# EAGLE design bottomPCB_f1 (EAGLE 8.4.2)
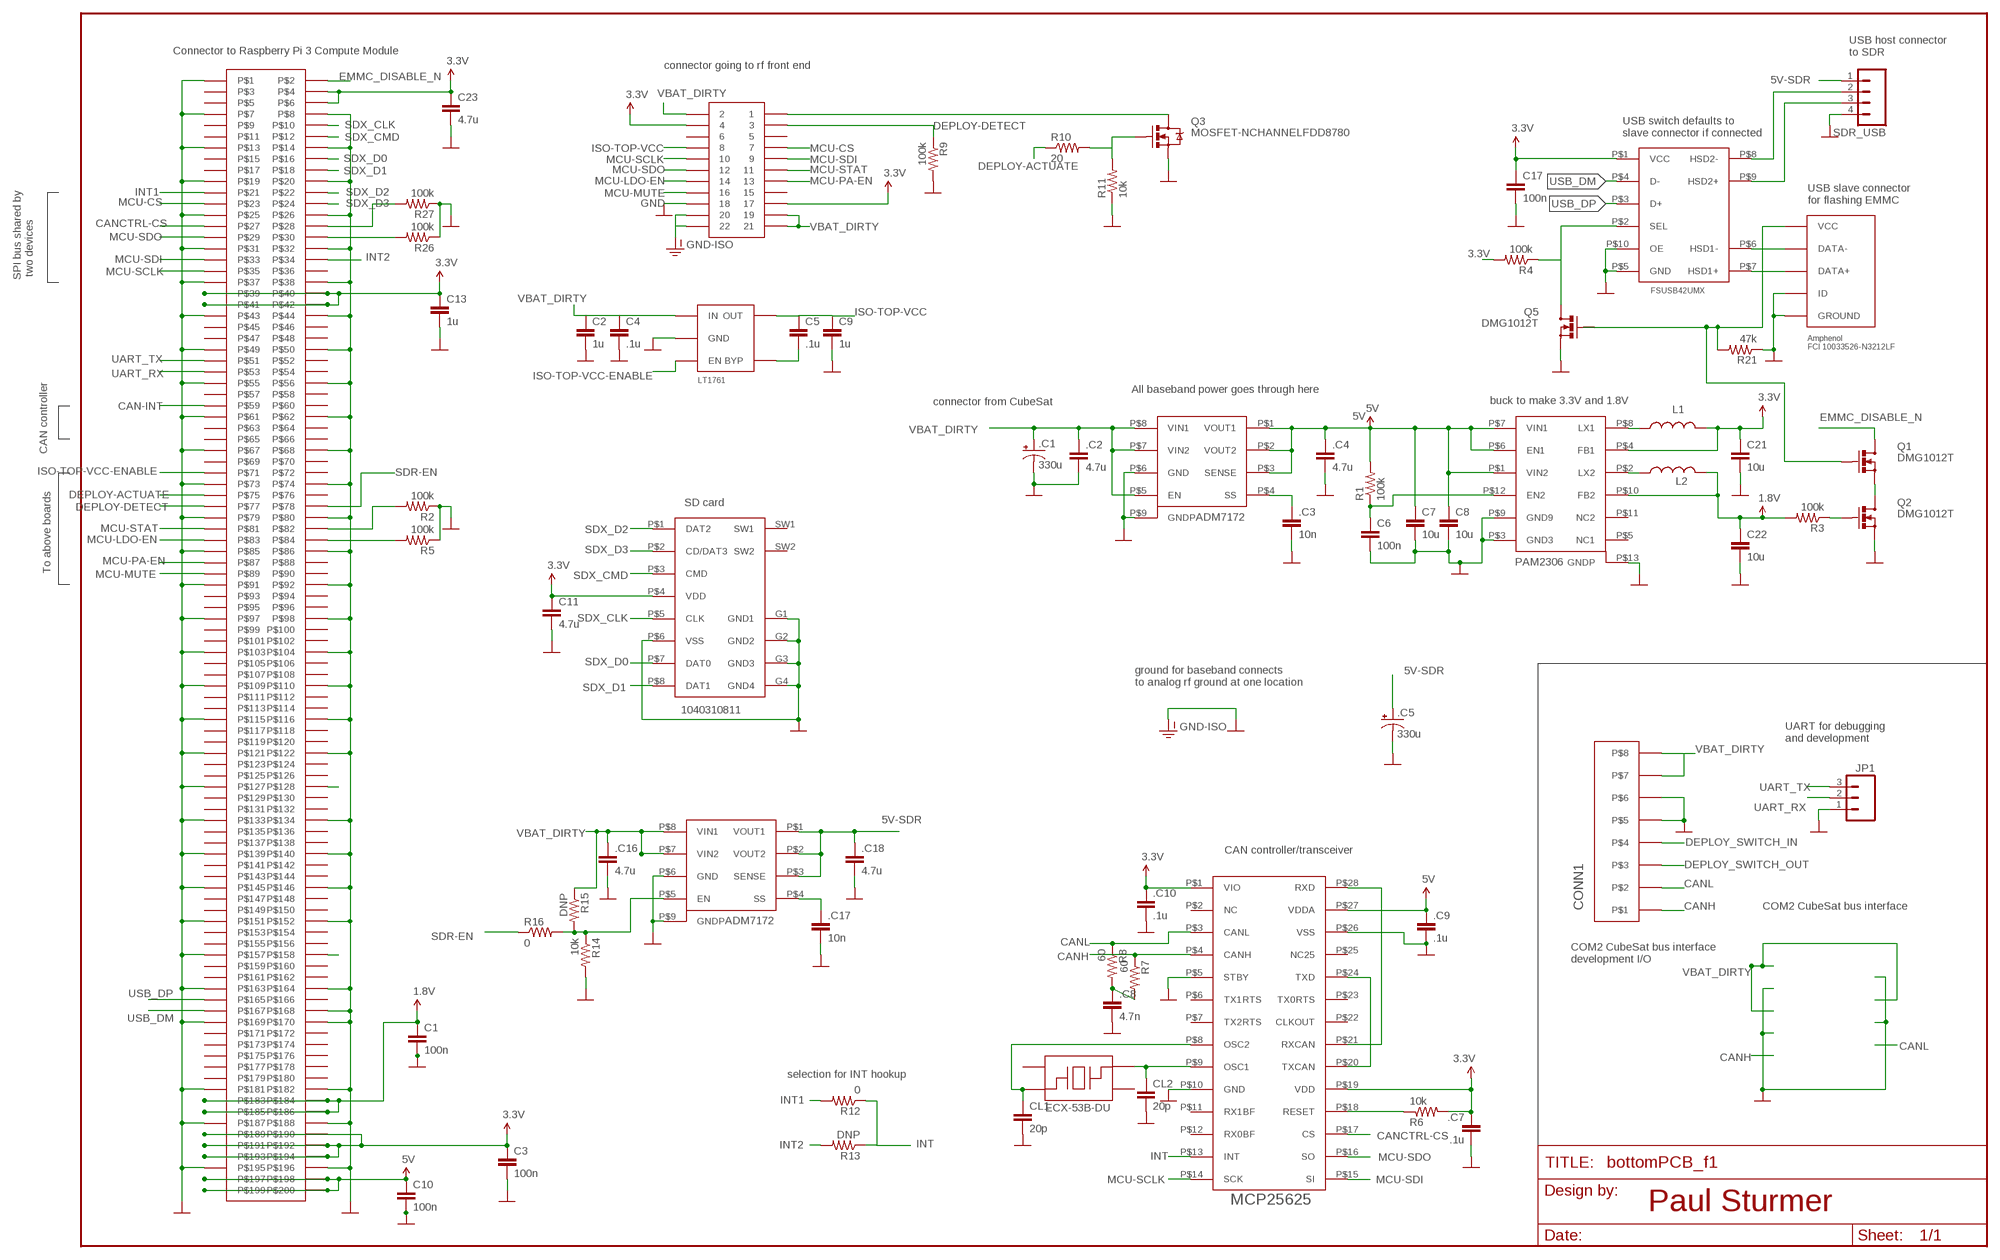
[diagram p0: schematic, sheet 1]

## Parts
.C1  330u  CAP_POL7343  [EIA7343]
.C2  4.7u  CAP1206  [1206]
.C3  10n  CAP0805  [0805]
.C4  4.7u  CAP1206  [1206]
.C5  330u  CAP_POL7343  [EIA7343]
.C7  .1u  CAP0805  [0805]
.C8  4.7n  CAP0805  [0805]
.C9  .1u  CAP0805  [0805]
.C10  .1u  CAP0805  [0805]
.C16  4.7u  CAP1206  [1206]
.C17  10n  CAP0805  [0805]
.C18  4.7u  CAP1206  [1206]
C1  100n  CAP0805  [0805]
C2  1u  CAP0805  [0805]
C3  100n  CAP0805  [0805]
C4  .1u  CAP0805  [0805]
C5  .1u  CAP0805  [0805]
C6  100n  CAP0805  [0805]
C7  10u  CAP1206  [1206]
C8  10u  CAP1206  [1206]
C9  1u  CAP0805  [0805]
C10  100n  CAP0805  [0805]
C11  4.7u  CAP0805  [0805]
C13  1u  CAP0805  [0805]
C17  100n  CAP0805  [0805]
C21  10u  CAP1206  [1206]
C22  10u  CAP1206  [1206]
C23  4.7u  CAP0805  [0805]
CL1  20p  CAP0805  [0805]
CL2  20p  CAP0805  [0805]
CONN1  PICOLOCK_8PICOLOCK_8  [PICOLOCK_8]
JP1  M03LOCK  [1X03_LOCK]
L1  INDUCTOR_SRN4018  [SDR0403]
L2  INDUCTOR_SRN4018  [SDR0403]
Q1  DMG1012T  [SOT523]
Q2  DMG1012T  [SOT523]
Q3  MOSFET-NCHANNELFDD8780  [DPAK]
Q5  DMG1012T  [SOT523]
R1  100k  RESISTOR0805-RES  [0805]
R2  100k  RESISTOR0805-RES  [0805]
R3  100k  RESISTOR0805-RES  [0805]
R4  100k  RESISTOR0805-RES  [0805]
R5  100k  RESISTOR0805-RES  [0805]
R6  10k  RESISTOR0805-RES  [0805]
R7  60  RESISTOR0805-RES  [0805]
R8  60  RESISTOR0805-RES  [0805]
R9  100k  RESISTOR0805-RES  [0805]
R10  20  RESISTOR0805-RES  [0805]
R11  10k  RESISTOR0805-RES  [0805]
R12  0  RESISTOR0805-RES  [0805]
R13  DNP  RESISTOR0805-RES  [0805]
R14  10k  RESISTOR0805-RES  [0805]
R15  DNP  RESISTOR0805-RES  [0805]
R16  0  RESISTOR0805-RES  [0805]
R21  47k  RESISTOR0805-RES  [0805]
R26  100k  RESISTOR0805-RES  [0805]
R27  100k  RESISTOR0805-RES  [0805]
SDR_USB  M04LOCK  [1X04_LOCK]
U$15  USB_MINI-B_AMPHENOL  [USB_MINI_B]
U$16  ANALOG_LDO_ADM7172  [8-LFCSP]
U$17  DIDOESINCORPORATED_BUCK_PAM2306  [WDFN-12L]
U$18  MICROCHIP_CAN_MCP25625_SSOP  [SSOP-28]
U$19  FAIRCHILD_USB_FSUSB42UMX  [MSOP_10_LEAD]
U$20  LINEAR_LDO_LT1761-X  [SOT-23-5]
U$21  DDR2_AMPHENOL_10033853-052FSLF  [DDR2]
U$22  SD_CARD_1040310811  [SD_CARD_1040310811]
U$24  ECS_CRYSTAL_ECX-53B-DU  [SMD_CRYSTAL]
U$26  ANALOG_LDO_ADM7172  [8-LFCSP]
U$180  SSW-111-XX-XXX-D  [SSW-111-XX-XXX-D]

## Nets
1.8V: C1.1 C22.1 L2.P$2 R3.2 U$17.P$10(FB2) U$21.P$183 U$21.P$184 U$21.P$185 U$21.P$186
3.3V: .C7.1 .C10.1 C3.1 C11.1 C13.1 C17.1 C21.1 C23.1 L1.P$2 R4.2 R6.2 U$17.P$4(FB1) U$18.P$1(VIO) U$18.P$19(VDD) U$19.P$1(VCC) U$21.P$4 U$21.P$6 U$21.P$39 U$21.P$40 U$21.P$41 U$21.P$42 U$21.P$189 U$21.P$190 U$21.P$191 U$21.P$192 U$21.P$193 U$21.P$194 U$22.P$4(VDD) U$180.4 U$180.17
5V: .C4.1 .C9.1 C7.1 C8.1 C10.1 R1.2 U$16.P$1(VOUT1) U$16.P$2(VOUT2) U$16.P$3(SENSE) U$17.P$1(VIN2) U$17.P$6(EN1) U$17.P$7(VIN1) U$18.P$27(VDDA) U$21.P$197 U$21.P$198 U$21.P$199 U$21.P$200
5V-SDR: .C5.A(+) .C18.1 SDR_USB.1 U$26.P$1(VOUT1) U$26.P$2(VOUT2) U$26.P$3(SENSE)
CAN-INT: U$21.P$59
CANCTRL-CS: U$18.P$17(CS) U$21.P$27
CANH: CONN1.P$1 R7.1 U$18.P$4(CANH)
CANL: CONN1.P$2 R8.1 U$18.P$3(CANL)
DEPLOY-ACTUATE: R10.1 U$21.P$75
DEPLOY-DETECT: R9.1 U$21.P$77 U$180.3
DEPLOY_NEG: Q3.4(D) U$180.1
DEPLOY_SWITCH_IN: CONN1.P$4
DEPLOY_SWITCH_OUT: CONN1.P$3
EMMC_DISABLE_N: Q1.D U$21.P$2
EN: R14.1 R15.2 R16.2 U$26.P$5(EN)
GND: .C1.C(-) .C2.2 .C3.2 .C4.2 .C5.C(-) .C7.2 .C8.2 .C9.2 .C10.2 .C16.2 .C17.2 .C18.2 C1.2 C2.2 C3.2 C4.2 C6.2 C7.2 C8.2 C9.2 C10.2 C11.2 C13.2 C17.2 C21.2 C22.2 C23.2 CL1.2 CL2.2 CONN1.P$5 CONN1.P$6 JP1.1 Q2.S Q3.3(S) Q5.S R2.1 R5.1 R9.2 R11.1 R14.2 R21.1 R26.1 R27.1 SDR_USB.4 U$15.GND1(GROUND) U$15.GND2(GROUND) U$15.GND3(GROUND) U$15.GND4(GROUND) U$15.GROUND U$15.ID U$16.P$6(GND) U$16.P$9(GNDP) U$17.P$3(GND3) U$17.P$9(GND9) U$17.P$13(GNDP) U$18.P$5(STBY) U$18.P$10(GND) U$18.P$26(VSS) U$19.P$5(GND) U$19.P$10(OE) U$20.P$2(GND) U$21.P$1 U$21.P$7 U$21.P$8 U$21.P$13 U$21.P$14 U$21.P$19 U$21.P$20 U$21.P$25 U$21.P$26 U$21.P$31 U$21.P$32 U$21.P$37 U$21.P$38 U$21.P$43 U$21.P$44 U$21.P$49 U$21.P$50 U$21.P$55 U$21.P$56 U$21.P$61 U$21.P$62 U$21.P$67 U$21.P$68 U$21.P$73 U$21.P$74 U$21.P$79 U$21.P$80 U$21.P$85 U$21.P$86 U$21.P$91 U$21.P$92 U$21.P$97 U$21.P$98 U$21.P$103 U$21.P$104 U$21.P$109 U$21.P$110 U$21.P$115 U$21.P$116 U$21.P$121 U$21.P$122 U$21.P$127 U$21.P$133 U$21.P$134 U$21.P$139 U$21.P$140 U$21.P$145 U$21.P$146 U$21.P$151 U$21.P$152 U$21.P$157 U$21.P$163 U$21.P$164 U$21.P$168 U$21.P$169 U$21.P$170 U$21.P$181 U$21.P$182 U$21.P$187 U$21.P$188 U$21.P$195 U$21.P$196 U$22.G1(GND1) U$22.G2(GND2) U$22.G3(GND3) U$22.G4(GND4) U$22.P$6(VSS) U$26.P$6(GND) U$26.P$9(GNDP) U$180.18 U$180.20 U$180.22 ; supply symbol labelled DGND, GND-ISO
INT: R12.1 R13.1 U$18.P$13(INT)
INT1: R12.2 U$21.P$21
INT2: R13.2 U$21.P$34
ISO-TOP-VCC: C5.1 C9.1 U$20.P$5(OUT) U$180.8
ISO-TOP-VCC-ENABLE: U$20.P$3(EN) U$21.P$71
MCU-CS: U$21.P$23 U$180.7
MCU-LDO-EN: U$21.P$83 U$180.14
MCU-MUTE: U$21.P$89 U$180.16
MCU-PA-EN: U$21.P$87 U$180.13
MCU-SCLK: U$18.P$14(SCK) U$21.P$35 U$180.10
MCU-SDI: U$18.P$15(SI) U$21.P$33 U$180.9
MCU-SDO: U$18.P$16(SO) U$21.P$29 U$180.12
MCU-STAT: U$21.P$81 U$180.11
N$1: L1.P$1 U$17.P$8(LX1)
N$2: .C3.1 U$16.P$4(SS)
N$3: Q1.S Q2.D
N$4: L2.P$1 U$17.P$2(LX2)
N$6: C6.1 R1.1 U$17.P$12(EN2)
N$7: R27.2 U$21.P$28
N$8: R26.2 U$21.P$30
N$9: U$15.DATA- U$19.P$6(HSD1-)
N$10: U$15.DATA+ U$19.P$7(HSD1+)
N$11: SDR_USB.2 U$19.P$8(HSD2-)
N$12: SDR_USB.3 U$19.P$9(HSD2+)
N$13: Q5.D R4.1 U$19.P$2(SEL)
N$14: R2.2 U$21.P$82
N$15: R5.2 U$21.P$84
N$16: C5.2 U$20.P$4(BYP)
N$17: R6.1 U$18.P$18(RESET)
N$18: U$18.P$20(TXCAN) U$18.P$24(TXD)
N$19: U$21.P$128
N$20: U$21.P$158
N$21: .C8.1 R7.2 R8.2
N$23: CL2.1 U$18.P$9(OSC1) U$24.P$3
N$24: CL1.1 U$18.P$8(OSC2) U$24.P$1
N$25: U$18.P$21(RXCAN) U$18.P$28(RXD)
N$26: Q3.1(G) R10.2 R11.2
N$31: .C17.1 U$26.P$4(SS)
Q2: Q2.G R3.1
SDR-EN: R16.1 U$21.P$78
SDX_CLK: U$21.P$10 U$22.P$5(CLK)
SDX_CMD: U$21.P$12 U$22.P$3(CMD)
SDX_D0: U$21.P$16 U$22.P$7(DAT0)
SDX_D1: U$21.P$18 U$22.P$8(DAT1)
SDX_D2: U$21.P$22 U$22.P$1(DAT2)
SDX_D3: U$21.P$24 U$22.P$2(CD/DAT3)
UART_RX: JP1.2 U$21.P$53
UART_TX: JP1.3 U$21.P$51
USB_DM: U$19.P$4(D-) U$21.P$167
USB_DP: U$19.P$3(D+) U$21.P$165
VBAT_DIRTY: .C1.A(+) .C2.1 .C16.1 C2.1 C4.1 CONN1.P$7 CONN1.P$8 R15.1 U$16.P$5(EN) U$16.P$7(VIN2) U$16.P$8(VIN1) U$20.P$1(IN) U$26.P$7(VIN2) U$26.P$8(VIN1) U$180.2 U$180.19 U$180.21
VBUSB: Q1.G Q5.G R21.2 U$15.VCC
Unconnected: U$17.P$5(NC1) U$17.P$11(NC2) U$18.P$2(NC) U$18.P$6(TX1RTS) U$18.P$7(TX2RTS) U$18.P$11(RX1BF) U$18.P$12(RX0BF) U$18.P$22(CLKOUT) U$18.P$23(TX0RTS) U$18.P$25(NC25) U$21.P$3 U$21.P$5 U$21.P$9 U$21.P$11 U$21.P$15 U$21.P$17 U$21.P$36 U$21.P$45 U$21.P$46 U$21.P$47 U$21.P$48 U$21.P$52 U$21.P$54 U$21.P$57 U$21.P$58 U$21.P$60 U$21.P$63 U$21.P$64 U$21.P$65 U$21.P$66 U$21.P$69 U$21.P$70 U$21.P$72 U$21.P$76 U$21.P$88 U$21.P$90 U$21.P$93 U$21.P$94 U$21.P$95 U$21.P$96 U$21.P$99 U$21.P$100 U$21.P$101 U$21.P$102 U$21.P$105 U$21.P$106 U$21.P$107 U$21.P$108 U$21.P$111 U$21.P$112 U$21.P$113 U$21.P$114 U$21.P$117 U$21.P$118 U$21.P$119 U$21.P$120 U$21.P$123 U$21.P$124 U$21.P$125 U$21.P$126 U$21.P$129 U$21.P$130 U$21.P$131 U$21.P$132 U$21.P$135 U$21.P$136 U$21.P$137 U$21.P$138 U$21.P$141 U$21.P$142 U$21.P$143 U$21.P$144 U$21.P$147 U$21.P$148 U$21.P$149 U$21.P$150 U$21.P$153 U$21.P$154 U$21.P$155 U$21.P$156 U$21.P$159 U$21.P$160 U$21.P$161 U$21.P$162 U$21.P$166 U$21.P$171 U$21.P$172 U$21.P$173 U$21.P$174 U$21.P$175 U$21.P$176 U$21.P$177 U$21.P$178 U$21.P$179 U$21.P$180 U$22.SW1 U$22.SW2 U$24.P$2 U$24.P$4 U$180.5 U$180.6 U$180.15

## Notes on the sheet
- Connector to Raspberry Pi 3 Compute Module
- USB host connector
  to SDR
- connector going to rf front end
- USB switch defaults to
  slave connector if connected
- USB slave connector
  for flashing EMMC
- SPI bus shared by
   two devices
- All baseband power goes through here
- connector from CubeSat | buck to make 3.3V and 1.8V
- CAN controller
- SD card
- To above boards
- ground for baseband connects 
  to analog rf ground at one location
- UART for debugging
  and development
- CAN controller/transceiver
- COM2 CubeSat bus interface
- COM2 CubeSat bus interface
  development I/O
- selection for INT hookup

## Library data of the parts
.C1 .C5 = SparkFun-Capacitors:CAP_POL: Capacitor Polarized These are standard SMD and PTH capacitors. Normally 10uF, 47uF, and 100uF in electrolytic and tantalum varieties. Always verify the external diameter of the through hole cap, it varies with capacity, voltage, and manufacturer. The EIA devices should be standard.
.C2-.C4 .C7-.C10 .C16-.C18 C1-C11 C13 C17 C21-C23 CL1 CL2 = SparkFun-Capacitors:CAP: Capacitor Standard 0603 ceramic capacitor, and 0.1" leaded capacitor.
CONN1 = DubSat1 Components:PICOLOCK_8
JP1 = SparkFun-Connectors:M03: Header 3 Standard 3-pin 0.1" header. Use with straight break away headers (SKU : PRT-00116), right angle break away headers (PRT-00553), swiss pins (PRT-00743), machine pins (PRT-00117), and female headers (PRT-00115). Molex polarized connector foot print use with SKU : PRT-08232 with associated crimp pins and housings.
L1 L2 = SparkFun-Passives:INDUCTOR_SRN4018
Q1 Q2 Q5 = SparkFun-DiscreteSemi:DMG1012T
Q3 = SparkFun-DiscreteSemi:MOSFET-NCHANNEL: Common NMOSFET Parts MFG P/N Store ID Prod ID FDD8780 TRANS-09984 SI7820DN TRANS-11055 FDS6630A IC-08089 2N7002PW TRANS-11151 FQP30N06L COM-10213 TRANS-10060 BSS123LT1G TRANS-08345 BSS138 TRANS-00830 BS170 2N7000; PROD_ID: TRANS-09984
R1-R16 R21 R26 R27 = SparkFun-Resistors:RESISTOR: Resistor Basic schematic elements and footprints for 0603, 1206, and PTH resistors.
SDR_USB = SparkFun-Connectors:M04: Header 4 Standard 4-pin 0.1" header. Use with straight break away headers (SKU : PRT-00116), right angle break away headers (PRT-00553), swiss pins (PRT-00743), machine pins (PRT-00117), and female headers (PRT-00115). Molex polarized connector foot print use with SKU : PRT-08231 with associated crimp pins and housings. 1MM SMD Version SKU: PRT-10208
U$15 = I_O_connectors:USB_MINI-B_AMPHENOL
U$16 U$26 = ICs:ANALOG_LDO_ADM7172
U$17 = ICs:DIDOESINCORPORATED_BUCK_PAM2306
U$18 = ICs:MICROCHIP_CAN_MCP25625_SSOP
U$19 = ICs:FAIRCHILD_USB_FSUSB42UMX
U$20 = ICs:LINEAR_LDO_LT1761-X
U$21 = I_O_connectors:DDR2_AMPHENOL_10033853-052FSLF
U$22 = I_O_connectors:SD_CARD_1040310811
U$24 = ICs:ECS_CRYSTAL_ECX-53B-DU
U$180 = I_O_connectors:SSW-111-XX-XXX-D

## Board
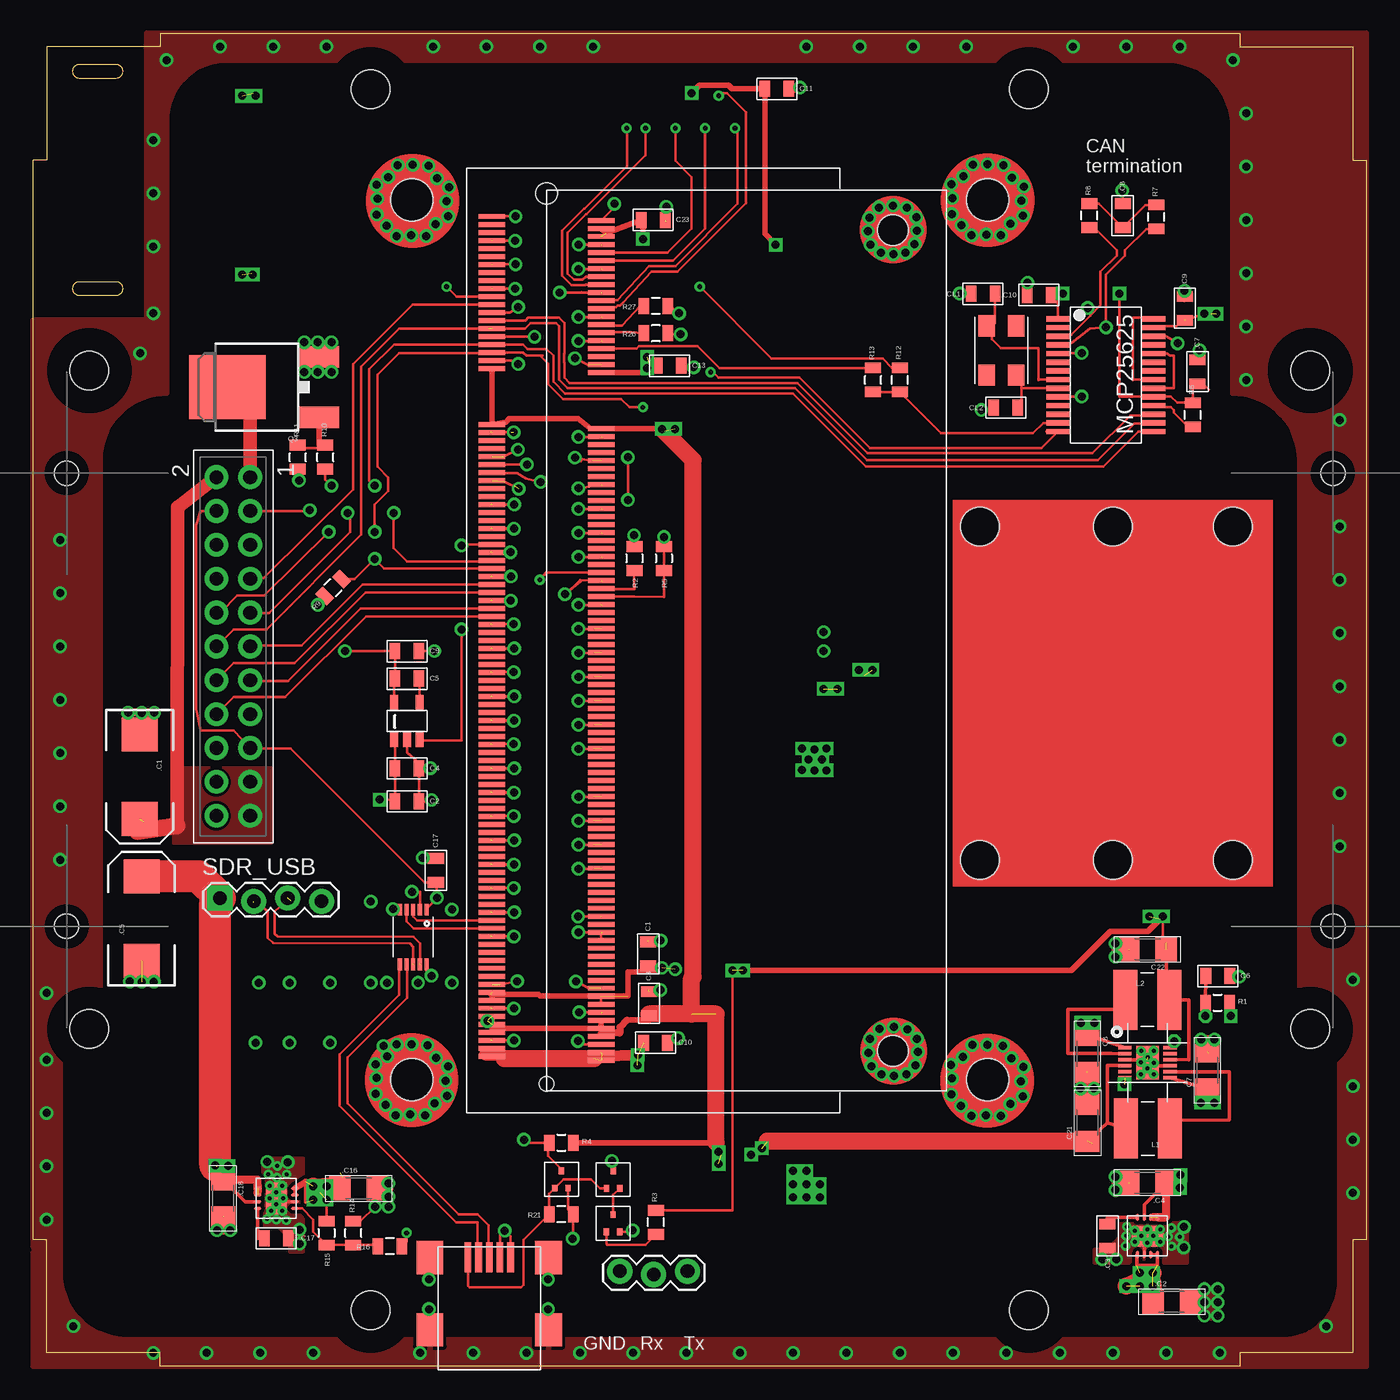
[diagram p1: board, top side]
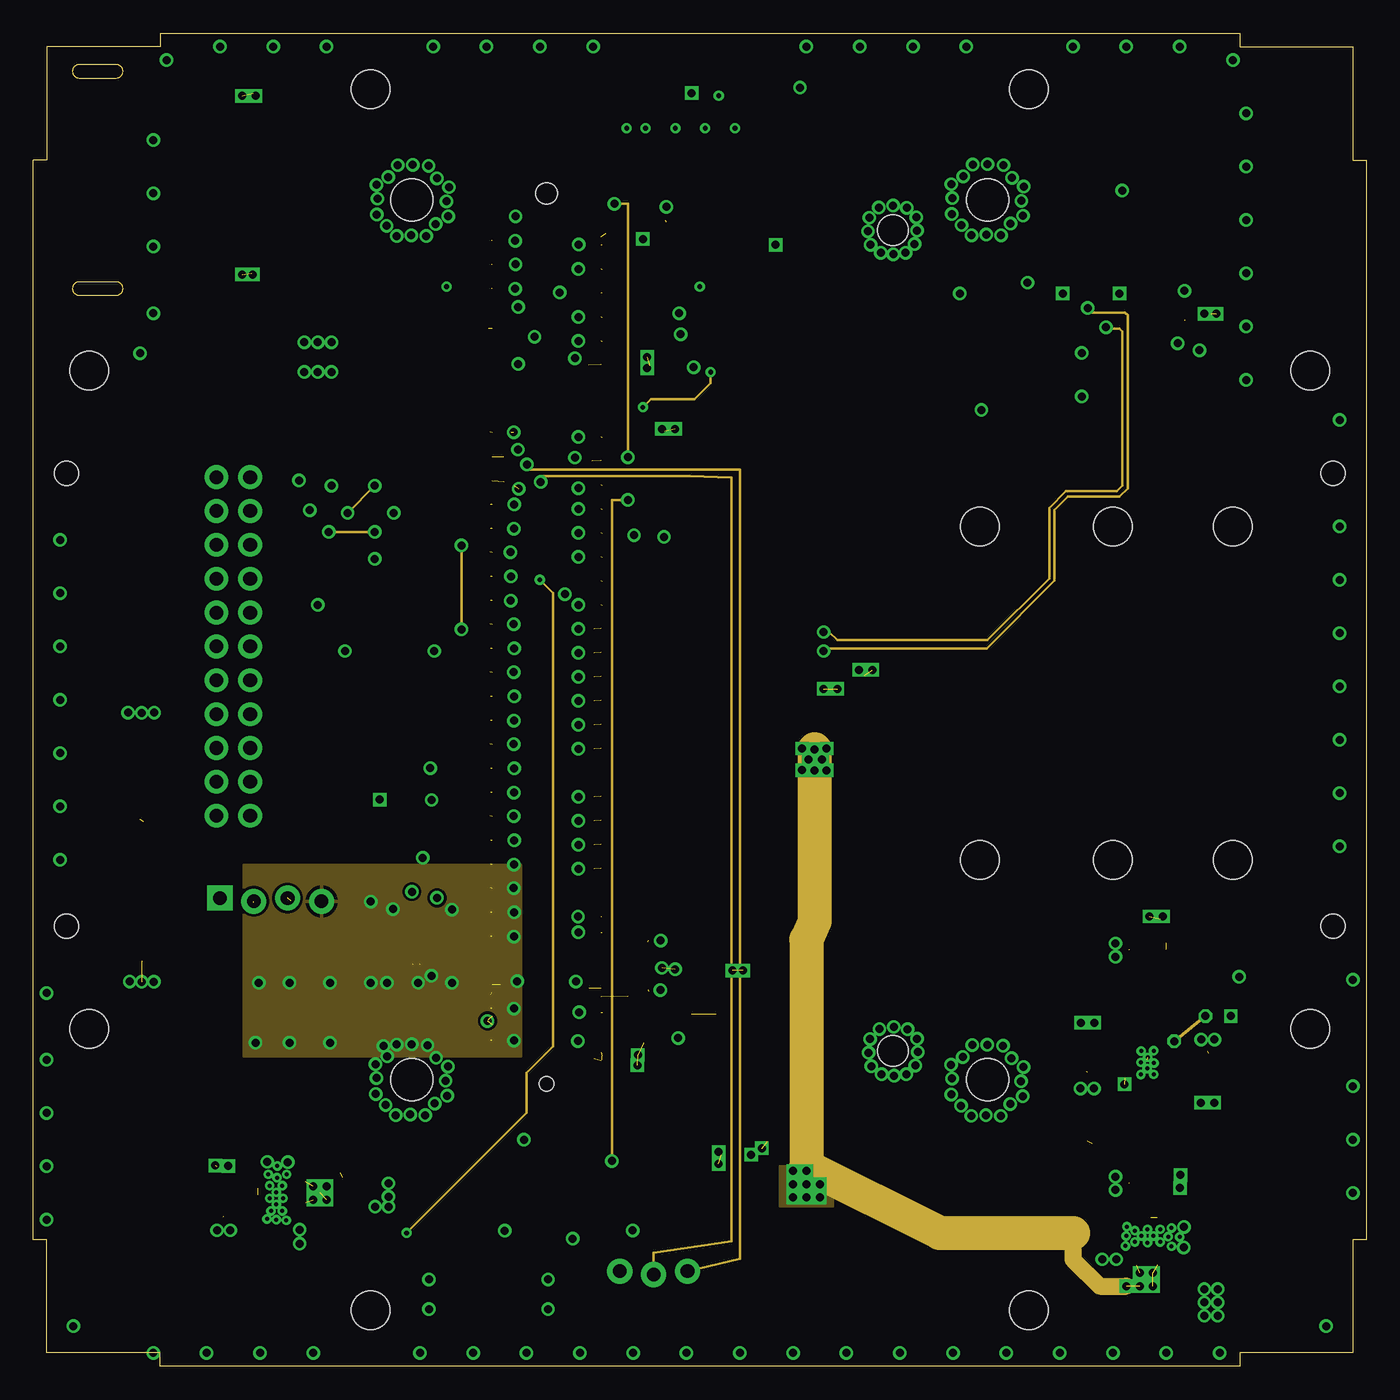
[diagram p2: board, inner layer Signals]
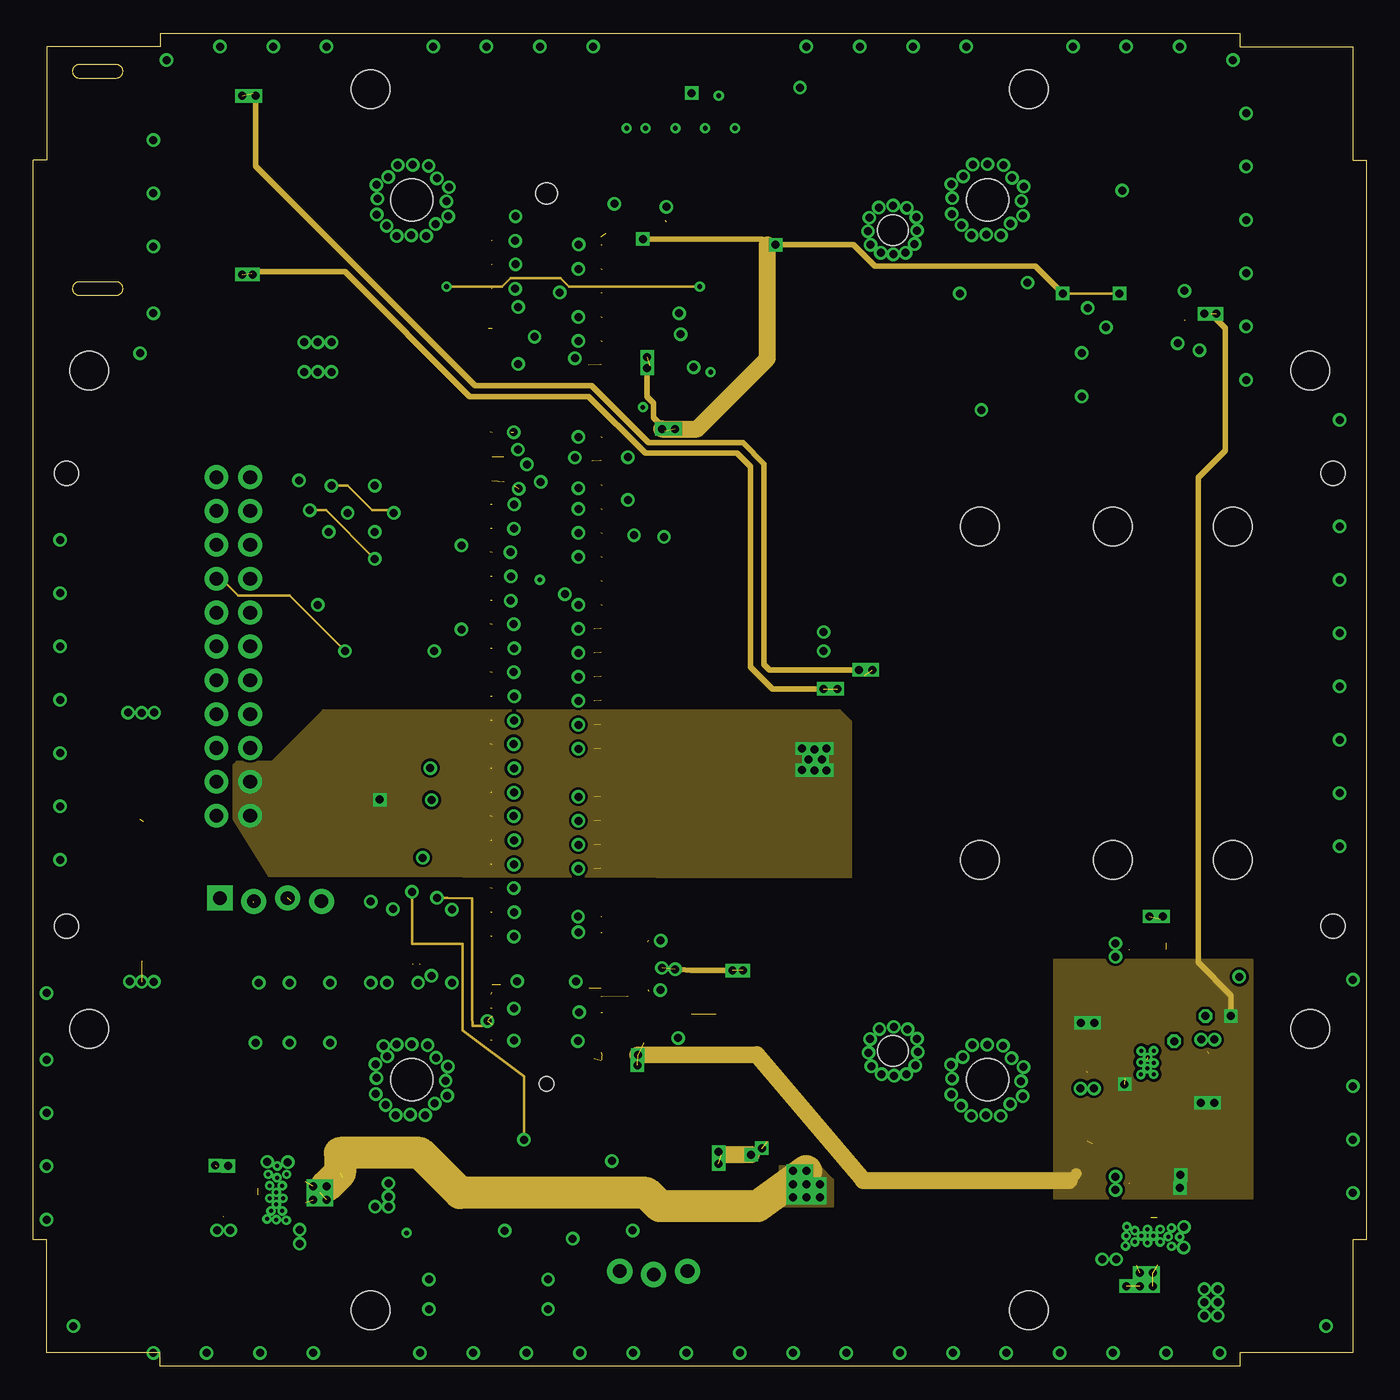
[diagram p3: board, inner layer DC_distribution]
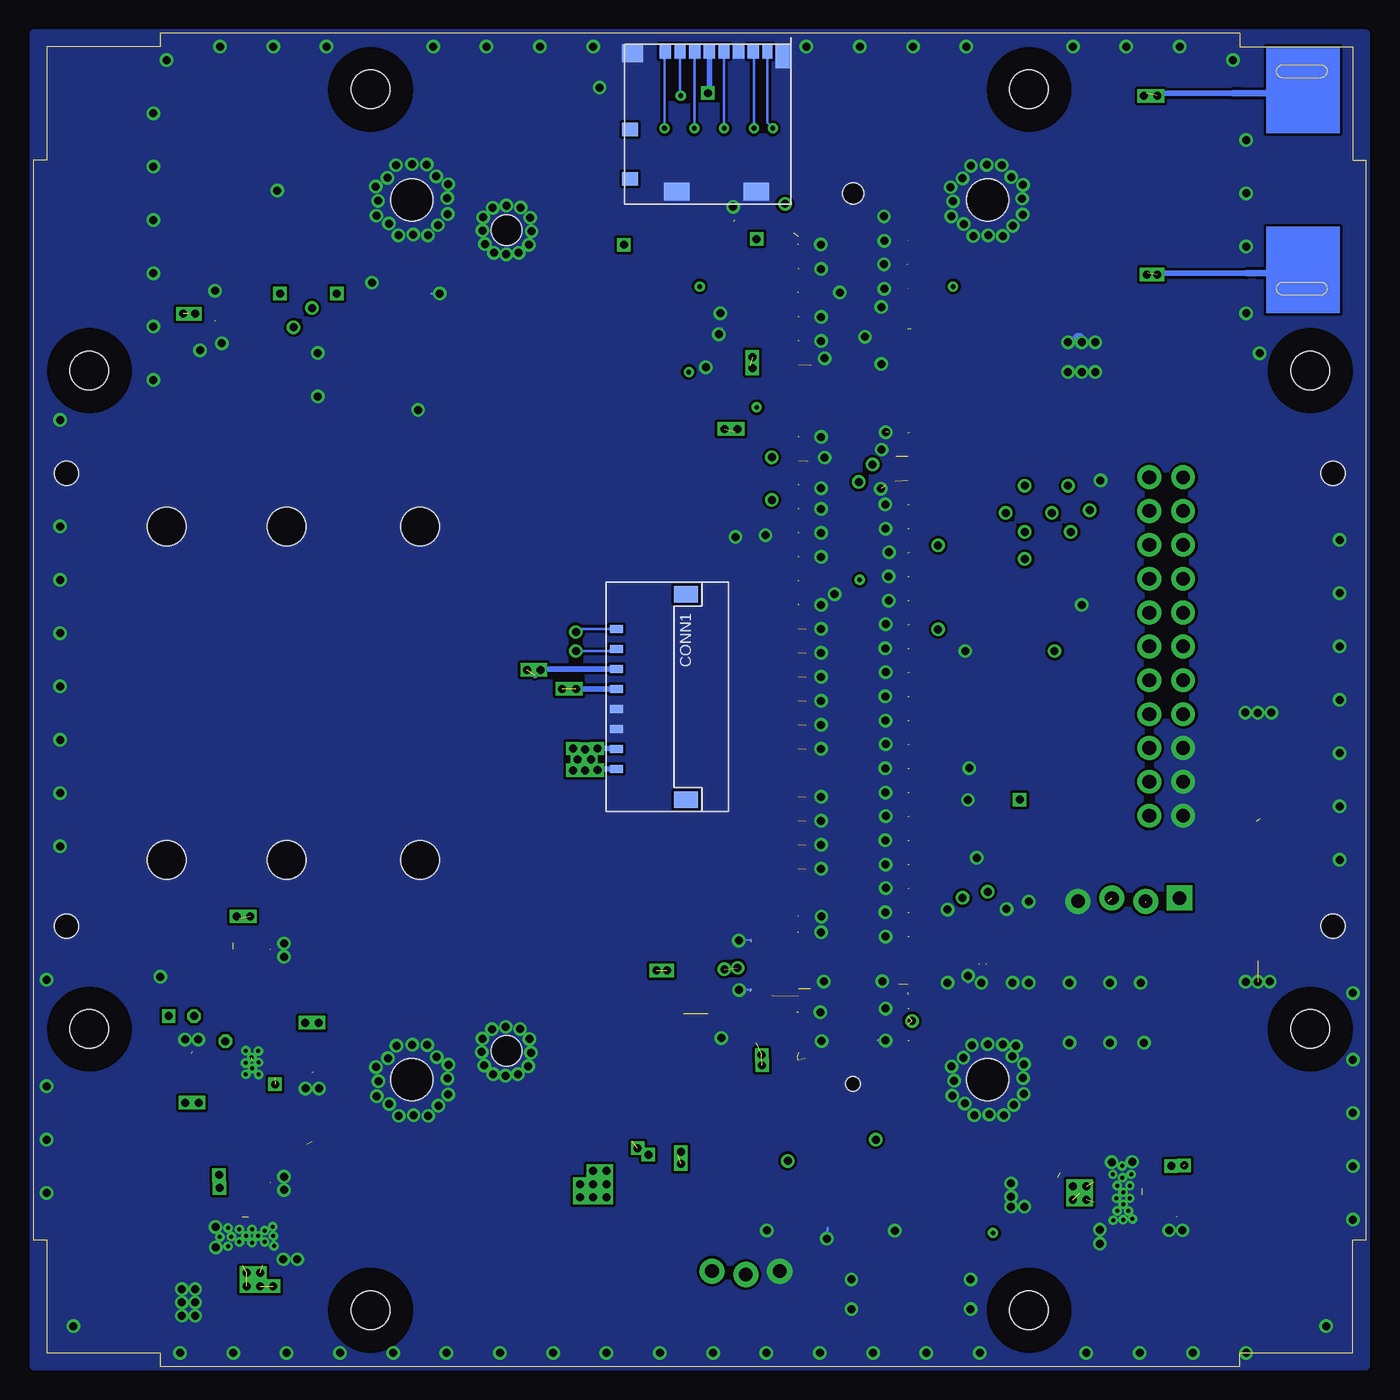
[diagram p4: board, bottom side, seen from below]

Size 100 x 100 mm. Coordinates in mm from the lower left corner, seen from the top.
Outline: 0,9.5 0,90.5 1,90.5 1,99 9.5,99 9.5,100 90.5,100 90.5,99 99,99 99,90.5 100,90.5 100,9.5 99,9.5 99,1 90.5,1 90.5,0 9.5,0 9.5,1 1,1 1,9.5 0,9.5
Outline: 6.23,96.65 arc90 6.73,97.15 arc90 6.23,97.65 3.43,97.65 arc90 2.93,97.15 arc90 3.43,96.65 6.23,96.65
Outline: 6.23,80.35 arc90 6.73,80.85 arc90 6.23,81.35 3.43,81.35 arc90 2.93,80.85 arc90 3.43,80.35 6.23,80.35
Copper layers (1*2*3*16): Top 0.035mm / dielectric 1.5mm / Signals 0.035mm / dielectric 0.15mm / DC_distribution 0.035mm / dielectric 0.2mm / GND 0.035mm
Design rules "default *": minimum track width 10mil, minimum drill 24mil, track to track 8mil, track to pad 8mil, pad to pad 8mil, via to via 8mil, smd to smd 8mil, copper to edge 0mil, drill to drill 8mil, minimum pad ring 10mil, minimum via ring 8mil, stop-mask expansion 4mil, vias tented up to drill 0mil, thermal gap 10mil
Holes 2.9 mm at 71,38 90,38 81,38 71,63 90,63 81,63

### Footprints (pad centres in the part's own frame; a part is rotated, then mirrored left to right if it is on the bottom)
EIA7343 = smd 2.55 x 2.7: A 3.17,0; C -3.17,0
1206 = smd 1.6 x 1.8: 1 -1.4,0; 2 1.4,0
0805 = smd 0.8 x 1.2: 1 -0.9,0; 2 0.9,0
PICOLOCK_8 = smd 1.25 x 1.8: MNT@1 -2.605,5.2; MNT@2 12.805,5.2 | smd 0.6 x 1: P$1 0,0; P$2 1.5,0; P$3 3,0; P$4 4.5,0; P$5 6,0; P$6 7.5,0; P$7 9,0; P$8 10.5,0
1X03_LOCK = drill 1.016 pad 1.88: 1 0,0.127; 2 2.54,-0.127; 3 5.08,0.127
SDR0403 = smd 1.8 x 4.5: P$1 -1.65,0; P$2 1.65,0
SOT523 = smd 0.4 x 0.51: D 0,0.65; G -0.5,-0.65; S 0.5,-0.65
DPAK = smd 1.6 x 3: 1 -2.28,-5.31; 3 2.28,-5.31 | smd 4.826 x 5.715: 4 0,1.588
1X04_LOCK = drill 1.016 pad 1.88 square: 1 0,0.127 | drill 1.016 pad 1.88: 2 2.54,-0.127; 3 5.08,0.127; 4 7.62,-0.127
#4-40_BOLT_HOLE = hole 2.9: 0,0
#1-72_BOLT_HOLE = hole 1.804: 0,0
USB_MINI_B = smd 0.5 x 2.25: DATA+ 0,5.45; DATA- -0.8,5.45; GROUND 1.6,5.45; ID 0.8,5.45; VCC -1.6,5.45 | smd 2 x 2.5: GND1 -4.45,0; GND2 -4.45,5.42; GND3 4.45,0; GND4 4.45,5.42
8-LFCSP = smd 0.6 x 0.24: P$1 -1.4,0.75; P$2 -1.4,0.25; P$3 -1.4,-0.25; P$4 -1.4,-0.75; P$5 1.4,-0.75; P$6 1.4,-0.25; P$7 1.4,0.25; P$8 1.4,0.75 | smd 1.6 x 2.44: P$9 0,0
WDFN-12L = smd 1 x 0.25: P$1 -1.7,1.125; P$2 -1.7,0.675; P$3 -1.7,0.225; P$4 -1.7,-0.225; P$5 -1.7,-0.675; P$6 -1.7,-1.125; P$7 1.7,-1.125; P$8 1.7,-0.675; P$9 1.7,-0.225; P$10 1.7,0.225; P$11 1.7,0.675; P$12 1.7,1.125 | smd 1.7 x 2.5: P$13 0,0
SSOP-28 = smd 0.4 x 1.75: P$1 -4.225,-3.6; P$2 -3.575,-3.6; P$3 -2.925,-3.6; P$4 -2.275,-3.6; P$5 -1.625,-3.6; P$6 -0.975,-3.6; P$7 -0.325,-3.6; P$8 0.325,-3.6; P$9 0.975,-3.6; P$10 1.625,-3.6; P$11 2.275,-3.6; P$12 2.925,-3.6; P$13 3.575,-3.6; P$14 4.225,-3.6; P$15 4.225,3.6; P$16 3.575,3.6; P$17 2.925,3.6; P$18 2.275,3.6; P$19 1.625,3.6; P$20 0.975,3.6; P$21 0.325,3.6; P$22 -0.325,3.6; P$23 -0.975,3.6; P$24 -1.625,3.6; P$25 -2.275,3.6; P$26 -2.925,3.6; P$27 -3.575,3.6; P$28 -4.225,3.6
MSOP_10_LEAD = smd 0.305 x 0.889: P$1 -1.001,-2.045; P$2 -0.5,-2.045; P$3 0,-2.045; P$4 0.5,-2.045; P$5 1.001,-2.045; P$6 1.001,2.045; P$7 0.5,2.045; P$8 0,2.045; P$9 -0.5,2.045; P$10 -1.001,2.045
SOT-23-5 = smd 0.6 x 1.2: P$1 -0.95,-1.35; P$2 0,-1.35; P$3 0.95,-1.35; P$4 0.95,1.35; P$5 -0.95,1.35
DDR2 = smd 0.35 x 2: P$1 -1.75,4.1; P$2 -2.05,-4.1; P$3 -2.35,4.1; P$4 -2.65,-4.1; P$5 -2.95,4.1; P$6 -3.25,-4.1; P$7 -3.55,4.1; P$8 -3.85,-4.1; P$9 -4.15,4.1; P$10 -4.45,-4.1; P$11 -4.75,4.1; P$12 -5.05,-4.1; P$13 -5.35,4.1; P$14 -5.65,-4.1; P$15 -5.95,4.1; P$16 -6.25,-4.1; P$17 -6.55,4.1; P$18 -6.85,-4.1; P$19 -7.15,4.1; P$20 -7.45,-4.1; P$21 -7.75,4.1; P$22 -8.05,-4.1; P$23 -8.35,4.1; P$24 -8.65,-4.1; P$25 -8.95,4.1; P$26 -9.25,-4.1; P$27 -9.55,4.1; P$28 -9.85,-4.1; P$29 -10.15,4.1; P$30 -10.45,-4.1; P$31 -10.75,4.1; P$32 -11.05,-4.1; P$33 -11.35,4.1; P$34 -11.65,-4.1; P$35 -11.95,4.1; P$36 -12.25,-4.1; P$37 -12.55,4.1; P$38 -12.85,-4.1; P$39 -13.15,4.1; P$40 -13.45,-4.1; P$41 -17.35,4.1; P$42 -17.65,-4.1; P$43 -17.95,4.1; P$44 -18.25,-4.1; P$45 -18.55,4.1; P$46 -18.85,-4.1; P$47 -19.15,4.1; P$48 -19.45,-4.1; P$49 -19.75,4.1; P$50 -20.05,-4.1; P$51 -20.35,4.1; P$52 -20.65,-4.1; P$53 -20.95,4.1; P$54 -21.25,-4.1; P$55 -21.55,4.1; P$56 -21.85,-4.1; P$57 -22.15,4.1; P$58 -22.45,-4.1; P$59 -22.75,4.1; P$60 -23.05,-4.1; P$61 -23.35,4.1; P$62 -23.65,-4.1; P$63 -23.95,4.1; P$64 -24.25,-4.1; P$65 -24.55,4.1; P$66 -24.85,-4.1; P$67 -25.15,4.1; P$68 -25.45,-4.1; P$69 -25.75,4.1; P$70 -26.05,-4.1; P$71 -26.35,4.1; P$72 -26.65,-4.1; P$73 -26.95,4.1; P$74 -27.25,-4.1; P$75 -27.55,4.1; P$76 -27.85,-4.1; P$77 -28.15,4.1; P$78 -28.45,-4.1; P$79 -28.75,4.1; P$80 -29.05,-4.1; P$81 -29.35,4.1; P$82 -29.65,-4.1; P$83 -29.95,4.1; P$84 -30.25,-4.1; P$85 -30.55,4.1; P$86 -30.85,-4.1; P$87 -31.15,4.1; P$88 -31.45,-4.1; P$89 -31.75,4.1; P$90 -32.05,-4.1; P$91 -32.35,4.1; P$92 -32.65,-4.1; P$93 -32.95,4.1; P$94 -33.25,-4.1; P$95 -33.55,4.1; P$96 -33.85,-4.1; P$97 -34.15,4.1; P$98 -34.45,-4.1; P$99 -34.75,4.1; P$100 -35.05,-4.1; P$101 -35.35,4.1; P$102 -35.65,-4.1; P$103 -35.95,4.1; P$104 -36.25,-4.1; P$105 -36.55,4.1; P$106 -36.85,-4.1; P$107 -37.15,4.1; P$108 -37.45,-4.1; P$109 -37.75,4.1; P$110 -38.05,-4.1; P$111 -38.35,4.1; P$112 -38.65,-4.1; P$113 -38.95,4.1; P$114 -39.25,-4.1; P$115 -39.55,4.1; P$116 -39.85,-4.1; P$117 -40.15,4.1; P$118 -40.45,-4.1; P$119 -40.75,4.1; P$120 -41.05,-4.1; P$121 -41.35,4.1; P$122 -41.65,-4.1; P$123 -41.95,4.1; P$124 -42.25,-4.1; P$125 -42.55,4.1; P$126 -42.85,-4.1; P$127 -43.15,4.1; P$128 -43.45,-4.1; P$129 -43.75,4.1; P$130 -44.05,-4.1; P$131 -44.35,4.1; P$132 -44.65,-4.1; P$133 -44.95,4.1; P$134 -45.25,-4.1; P$135 -45.55,4.1; P$136 -45.85,-4.1; P$137 -46.15,4.1; P$138 -46.45,-4.1; P$139 -46.75,4.1; P$140 -47.05,-4.1; P$141 -47.35,4.1; P$142 -47.65,-4.1; P$143 -47.95,4.1; P$144 -48.25,-4.1; P$145 -48.55,4.1; P$146 -48.85,-4.1; P$147 -49.15,4.1; P$148 -49.45,-4.1; P$149 -49.75,4.1; P$150 -50.05,-4.1; P$151 -50.35,4.1; P$152 -50.65,-4.1; P$153 -50.95,4.1; P$154 -51.25,-4.1; P$155 -51.55,4.1; P$156 -51.85,-4.1; P$157 -52.15,4.1; P$158 -52.45,-4.1; P$159 -52.75,4.1; P$160 -53.05,-4.1; P$161 -53.35,4.1; P$162 -53.65,-4.1; P$163 -53.95,4.1; P$164 -54.25,-4.1; P$165 -54.55,4.1; P$166 -54.85,-4.1; P$167 -55.15,4.1; P$168 -55.45,-4.1; P$169 -55.75,4.1; P$170 -56.05,-4.1; P$171 -56.35,4.1; P$172 -56.65,-4.1; P$173 -56.95,4.1; P$174 -57.25,-4.1; P$175 -57.55,4.1; P$176 -57.85,-4.1; P$177 -58.15,4.1; P$178 -58.45,-4.1; P$179 -58.75,4.1; P$180 -59.05,-4.1; P$181 -59.35,4.1; P$182 -59.65,-4.1; P$183 -59.95,4.1; P$184 -60.25,-4.1; P$185 -60.55,4.1; P$186 -60.85,-4.1; P$187 -61.15,4.1; P$188 -61.45,-4.1; P$189 -61.75,4.1; P$190 -62.05,-4.1; P$191 -62.35,4.1; P$192 -62.65,-4.1; P$193 -62.95,4.1; P$194 -63.25,-4.1; P$195 -63.55,4.1; P$196 -63.85,-4.1; P$197 -64.15,4.1; P$198 -64.45,-4.1; P$199 -64.75,4.1; P$200 -65.05,-4.1 | hole 1.6: 0,0 | hole 1.1: -66.8,0 | hole 2.3: -2.75,-26; -64.35,-26
SD_CARD_1040310811 = smd 1.55 x 1.35: G1 11.905,0.675 | smd 1.17 x 1.8: G2 0.585,0.9 | smd 1.9 x 1.35: G3 2.61,11.075; G4 8.58,11.075 | smd 0.85 x 1.1: P$1 9.445,0.55; P$2 8.345,0.55; P$3 7.245,0.55; P$4 6.145,0.55; P$5 5.045,0.55; P$6 3.945,0.55; P$7 2.845,0.55 | smd 0.75 x 1.1: P$8 1.795,0.55 | smd 1.2 x 1: SW1 12.08,6.4; SW2 12.08,10.1
SDR_B200MINI = hole 3.18: -33,21.6; -33,-21.6; 33,21.6; 33,-21.6
SMD_CRYSTAL = smd 1.6 x 1.25: P$1 -1.85,-1.1; P$2 1.85,-1.1; P$3 1.85,1.1; P$4 -1.85,1.1
SSW-111-XX-XXX-D = drill 1.016 pad 1.778: 1 12.7,-1.27; 2 12.7,1.27; 3 10.16,-1.27; 4 10.16,1.27; 5 7.62,-1.27; 6 7.62,1.27; 7 5.08,-1.27; 8 5.08,1.27; 9 2.54,-1.27; 10 2.54,1.27; 11 0,-1.27; 12 0,1.27; 13 -2.54,-1.27; 14 -2.54,1.27; 15 -5.08,-1.27; 16 -5.08,1.27; 17 -7.62,-1.27; 18 -7.62,1.27; 19 -10.16,-1.27; 20 -10.16,1.27; 21 -12.7,-1.27; 22 -12.7,1.27

### Placement (x,y rotation side)
.C1  7.98,44.23 270 top
.C2  85.41,4.83 0 top
.C3  80.59,9.77 270 top
.C4  83.59,13.77 180 top
.C5  8.12,33.58 90 top
.C7  87.34,74.6 90 top
.C8  81.73,86.32 90 top
.C9  86.39,79.37 90 top
.C10  75.45,80.37 180 top
.C16  24.41,13.33 0 top
.C17  18.23,9.59 0 top
.C18  14.23,12.59 270 top
C1  46.13,30.93 90 top
C2  28.03,42.37 0 top
C3  46.19,27.21 90 top
C4  28.03,44.84 0 top
C5  28.03,51.58 0 top
C6  88.86,29.27 0 top
C7  88.07,22.2 90 top
C8  79.08,23.44 270 top
C9  28.03,53.64 0 top
C10  46.68,24.27 0 top
C11  55.78,95.84 0 top
C13  47.72,75.06 0 top
C17  30.2,37.2 90 top
C21  79.09,18.27 90 top
C22  83.59,31.27 180 top
C23  46.5,86 0 top
CL1  71.26,80.45 180 top
CL2  72.95,71.91 180 top
CONN1  56.25,55.31 270 bottom
JP1  44,7 0 top
L1  83.61,17.83 180 top
L2  83.58,27.49 0 top
Q1  43.5,14 0 top
Q2  43.49,10.73 0 top
Q3  16.14,73.46 90 top
Q5  39.62,14.01 0 top
R1  88.84,27.27 0 top
R2  45.1,60.6 270 top
R3  46.7,10.8 90 top
R4  39.62,16.77 0 top
R5  47.3,60.6 270 top
R6  86.99,71.38 90 top
R7  84.24,86.22 90 top
R8  79.23,86.32 90 top
R9  22.49,58.42 225 top
R10  21.91,68.2 90 top
R11  19.84,68.2 90 top
R12  65,74 90 top
R13  63,74 90 top
R14  24,10 90 top
R15  22,10 270 top
R16  26.75,9 180 top
R21  39.6,11.4 180 top
R26  46.7,77.5 180 top
R27  46.7,79.54 180 top
SDR_USB  14,35 0 top
U$1  [#4-40_BOLT_HOLE]  4.2,74.7 0 top
U$2  [#4-40_BOLT_HOLE]  25.3,95.8 0 top
U$3  [#4-40_BOLT_HOLE]  74.7,95.8 0 top
U$4  [#4-40_BOLT_HOLE]  95.8,74.7 0 top
U$5  [#1-72_BOLT_HOLE]  2.5,67 0 top
U$6  [#1-72_BOLT_HOLE]  97.5,67 0 top
U$7  [#4-40_BOLT_HOLE]  95.8,25.3 180 top
U$8  [#4-40_BOLT_HOLE]  74.7,4.2 180 top
U$9  [#4-40_BOLT_HOLE]  25.3,4.2 180 top
U$10  [#4-40_BOLT_HOLE]  4.2,25.3 180 top
U$11  [#1-72_BOLT_HOLE]  97.5,33 180 top
U$12  [#1-72_BOLT_HOLE]  2.5,33 180 top
U$15  34.2,2.73 0 top
U$16  83.59,9.77 270 top
U$17  83.59,22.77 0 top
U$18  80.47,74.35 270 top
U$19  28.5,32.2 180 top
U$20  28.03,48.4 0 top
U$21  38.5,88 90 top
U$22  43.14,99.18 180 bottom
U$23  [SDR_B200MINI]  50,54.5 270 top
U$24  72.63,76.21 270 top
U$26  18.23,12.59 0 top
U$180  15,54 90 top

### Tracks (layer width: path | path; a pad name or v marks a point on that pad's centre or on a via)
1.8V  (via drill 0.6)  (6 unrouted)
  Top 0.203: 84.99,31.77 84.59,32.17 | 84.59,32.17 84.65,31.81 84.8,31.95 | 38,27.8 37.89,27.91 | C1.1 45.7,29.6 46.57,29.6 46.57,29.48 v47.16,29.88 | U$21.P$186 U$21.P$184 | R3.2 52.44,11.7 v52.44,29.68 | v84.75,33.74 84.75,32.32 84.59,32.17
  Top 0.254: U$17.P$10 85.31,23 86.68,22.99 86.68,27.49 L2.P$2 84.99,27.73 C22.1
  Top 0.406: 38,27.8 44.6,27.8 44.6,29.6 45.7,29.6 | 37.89,27.91 34.35,27.91 | U$21.P$185 U$21.P$183 | v52.44,29.68 77.87,29.68 80.82,32.63 83.63,32.63 v84.75,33.74
  DC_distribution 0.203: 84.54,33.54 v84.75,33.74
  DC_distribution 0.406: v52.44,29.68 49.39,29.68 v47.16,29.88
  other vias: 53.25,29.68 48.16,29.78 83.75,33.74
3.3V  (via drill 0.6)  (10 unrouted)
  Top 0.203: U$21.P$193 34.7,25.35 | U$21.P$190 42.62,25.97 | 45.93,25.98 C3.1 46.19,26.43 | 42.95,85 43.15,84.8 | v30.29,35.14 29.5,34.35 U$19.P$1 29.5,34.32 30.25,35.07 30.25,36.25 C17.1 29.36,36.3 19.32,46.34 16.31,46.34 U$180.17 15.04,47.69 12.56,47.69 12.2,49.29 12.2,63.11 12.55,64.16 U$180.4 | U$18.P$1 76.87,79.85 .C10.1 76.35,80.48 v77.23,80.48 | 84.11,72.76 85.36,72.76 85.84,72.28 R6.2 86.99,73.55 .C7.1 87.74,73.7 88.18,73.27 | 84.11,72.76 U$18.P$19 | 79.46,16.67 78.25,16.67 | 84.11,72.76 81.5,72.76 v81.5,80.48 | U$21.P$39 34.4,72.96 | v51.42,16.07 51.22,16.27
  Top 0.254: L1.P$2 80.59,18.24 | 80.59,18.24 80.59,22.55 U$17.P$4 | 80.59,18.24 C21.1
  Top 0.406: U$21.P$4 42.95,85 C23.1 45.73,85.87 v45.73,84.57 | U$21.P$193 U$21.P$189 | 34.7,25.35 U$21.P$192 | U$21.P$190 U$21.P$192 | U$21.P$194 42.6,25 U$21.P$192 | 45.93,25.98 44.55,25.97 | R4.2 51.22,16.77 51.22,16.27 | U$21.P$39 U$21.P$41 35.48,70.85 35.7,71.08 40.88,71.08 41.81,70.35 U$21.P$42 47.12,70.35 v47.16,70.32 47.36,70.12 | 55.07,16.87 54.06,15.86 v53.86,15.86 | U$21.P$40 45.73,74.55 v46.06,74.87 46.24,75.06 C13.1 | v49.39,95.52 49.97,96.1 52.17,96.1 52.43,95.84 C11.1 54.88,84.95 v55.69,84.14 | v49.39,95.52
  Top 0.508: 44.55,25.97 44,25.42 44,25 42.6,25
  Top 1.27: 51.22,16.77 51.22,26.43 46.19,26.43 | C21.1 55.07,16.87 | 49.39,26.43 49.39,29.12 49.5,29.23 49.5,67.98 47.36,70.12
  DC_distribution 0.203: v30.29,35.14 31.07,35.14 32.93,35.11 32.93,26.26 32.95,25.53 33.66,25.53 34.1,25.97 | v77.23,80.48 v81.5,80.48
  DC_distribution 0.406: 51.63,15.86 v51.42,16.07 | v46.06,74.87 46.06,72.73 46.52,72.27 46.52,71.16 47.16,70.52 v47.16,70.32 | v45.73,84.57 46.12,84.57 46.14,84.54 54.67,84.54 55.08,84.14 v55.69,84.14 61.53,84.14 63.16,82.52 75.19,82.52 v77.23,80.48
  DC_distribution 1.27: v53.86,15.86 51.63,15.86 | v47.16,70.32 49.8,70.32 55.08,75.6 55.08,84.14
  GND 0.406: v49.39,95.52 49.29,95.62 U$22.P$4
  other vias: 34.07,25.89 54.66,16.36 51.42,15.17 48.16,70.32 46.06,75.72
5V  (via drill 0.6)  (9 unrouted)
  Top 0.203: U$21.P$197 34.7,23.55 | 34.7,23.55 35.06,23.45 | U$21.P$199 34.7,23.55 | U$21.P$200 42.65,23 | U$18.P$27 84.19,78.04 85.76,78.04 86.15,78.43 .C9.1 | v87.87,78.96 86.37,78.45 86.37,78.65
  Top 0.254: U$16.P$3 83.34,12.12 .C4.1 | .C4.1 85.29,13.77 85.36,14.17 | U$17.P$6 81.59,21.65 | U$17.P$1 81.87,23.92 C8.1 79.08,25.66 79.54,25.66 79.54,25.77 v78.59,25.77 | C7.1 U$17.P$7 | v87.59,19.77 88.07,19.77 C7.1 | C7.1 88.59,20.8 88.59,19.74 | 86,13.37 84.99,13.37 .C4.1 | v86.02,13.37 86,13.37 | 86,13.37 86,14.26 | R1.2 89.84,26.77 v89.84,26.27
  Top 0.61: U$16.P$1 84.99,11.17 .C4.1
  Top 0.813: 35.06,23.45 35.34,23.08 | 42.69,23.28 v45.35,23.36
  Top 1.016: 33.97,23.45 35.06,23.45
  Top 1.27: 35.34,23.08 42.08,23.08
  DC_distribution 0.203: 88.89,78.4 88.33,78.96 v87.87,78.96
  DC_distribution 0.406: v89.84,26.27 89.84,27.84 87.39,30.29 87.39,66.66 89.42,68.69 89.42,77.86 88.33,78.96
  DC_distribution 0.813: 77.64,13.83 78.25,14.44
  DC_distribution 1.27: v45.35,23.36 54.27,23.38 62.27,13.93 77.72,13.93
  other vias: 88.59,19.77 79.59,25.77 86.06,14.34 81.87,21.15 45.33,22.57 88.77,78.96
  pour DC_distribution: 76.62,30.49 91.45,30.49 91.45,12.61 76.62,12.61
5V-SDR  (via drill 0.6)  (2 unrouted)
  Top 0.254: U$26.P$3 15.88,12.34 .C18.1 | .C18.1 14.23,14.29 13.83,14.36 | 14.63,15 14.63,13.99 .C18.1 | v14.63,15.02 14.63,15 | 14.63,15 13.74,15
  Top 0.61: U$26.P$1 16.83,13.99 .C18.1
  Top 2.4: v13.66,15.06 13.66,34.79 SDR_USB.1 12.37,36.75 .C5.A
CAN-INT
  Top 0.203: 34,65.25 U$21.P$59
CANCTRL-CS
  Top 0.203: U$18.P$17 83.98,71.34 82.31,71.34 79.46,68.49 62.6,68.49 57.31,73.77 40.25,73.77 39.84,74.18 39.84,75.28 39.83,75.28 39.83,75.95 39.84,75.96 39.84,78.25 39.43,78.65 37.13,78.65 36.93,78.45 U$21.P$27
CANH  (via drill 0.6)
  Top 0.203: U$18.P$4 76.99,76.74 77.87,76.74 79.26,77.84 v80.48,77.94 80.48,81.9 81.9,83.33 81.9,83.73 83.49,85.32 R7.1
  Signals 0.203: v59.3,55.08 59.71,55.08 60.31,54.47 71.57,54.47 76.21,59.11 76.21,64.39 77.47,65.65 81.29,65.65 81.7,66.05 81.7,77.64 81.5,77.84 80.48,77.84 v80.48,77.94
  GND 0.203: CONN1.P$1 59.06,55.31 v59.3,55.08
CANL  (via drill 0.6)
  Top 0.203: U$18.P$3 76.99,77.39 77.87,77.39 79.3,78.82 | 79.3,78.82 80.07,79.59 80.07,82.11 81.29,83.33 81.29,83.73 79.6,85.42 R8.1 | 79.3,78.82 79.3,79.02 79.02,79.3 v79.1,79.4
  Signals 0.203: v79.1,79.4 79.24,79.06 81.9,79.06 82.11,78.85 82.11,65.85 81.5,65.24 77.64,65.24 76.62,64.22 76.62,58.94 71.54,53.86 59.71,53.86 59.5,53.66 v59.3,53.66
  GND 0.203: v59.3,53.66 56.41,53.66 CONN1.P$2
DEPLOY-ACTUATE  (via drill 0.6)
  Top 0.203: R10.1 21.91,66.51 v22.36,66.05 | v27.04,64.02 27.04,61.38 28.05,60.36 34.31,60.36 U$21.P$75
  DC_distribution 0.203: v22.36,66.05 23.58,66.05 25.41,64.22 26.84,64.22 v27.04,64.02
DEPLOY-DETECT  (via drill 0.6)
  Top 0.203: U$180.3 20.68,64.16 v20.74,64.22 | U$21.P$77 26.33,59.85 v25.62,60.57 24.1,59.05 R9.1
  DC_distribution 0.203: v20.74,64.22 21.96,64.22 v25.62,60.57
DEPLOY_NEG
  Top 1.016: U$180.1 16.27,72.96 Q3.4
DEPLOY_SWITCH_IN  (via drill 0.6)  (2 unrouted)
  DC_distribution 0.406: v59.3,50.81 55.44,50.81 53.81,52.44 53.81,67.47 52.8,68.49 45.94,68.49 41.67,72.76 32.73,72.76 23.38,82.11 16.47,82.11 v16.47,81.9
  GND 0.406: CONN1.P$4 v59.3,50.81 | v16.47,81.9 16.37,82 8.14,82
  GND 0.5: 7,82 8.14,82 9,82
  other vias: 60.32,50.81 15.66,81.9
DEPLOY_SWITCH_OUT  (via drill 0.6)  (2 unrouted)
  DC_distribution 0.406: v61.94,52.23 55.23,52.23 54.83,52.64 54.83,67.68 53.23,69.28 46.72,69.28 46.7,69.3 46.14,69.3 41.87,73.57 33.13,73.57 16.67,90.03 v16.67,95.31 16.67,95.52
  GND 0.406: CONN1.P$3 61.86,52.31 v61.94,52.23 62.35,51.83 | v16.67,95.31 16.49,95.5 9.36,95.5
  GND 0.5: 7.5,95.5 9.36,95.5 10,95.5
  other vias: 62.96,52.24 15.66,95.31
EMMC_DISABLE_N  (via drill 0.6)
  Top 0.203: Q1.D 43.5,15.1 v43.4,15.4 | v44.6,65 v44.6,68.19 | v43.6,87.2 43.85,87.2 U$21.P$2
  Signals 0.203: v43.4,15.4 43.4,65 v44.6,65 | v44.6,68.19 44.6,87.2 v43.6,87.2
EN
  Top 0.203: U$26.P$5 20.16,11.84 21,11 21,10.1 R15.2 R14.1 25.75,9.1 R16.2
GND  (via drill 0.3, 0.6)  (68 unrouted)
  Top 0.203: U$21.P$1 34.42,86.27 v36.18,86.27 35.98,86.27 35.96,86.25 | U$21.P$7 v36.15,84.44 35.95,84.44 35.93,84.42 | 34.42,82.67 v36.18,82.67 35.98,82.67 35.96,82.65 | U$21.P$19 v36.15,80.84 35.95,80.84 35.93,80.82 | 42.65,78.72 v40.89,78.72 41.09,78.72 41.11,78.74 | 42.68,80.55 v39.5,80.55 41.12,80.55 41.14,80.57 | 42.65,82.32 v40.89,82.32 41.09,82.32 41.11,82.34 | 42.68,84.15 v40.92,84.15 41.12,84.15 41.14,84.17 | 47.69,85.55 v47.49,86.99 47.69,85.64 47.47,85.86 | 34.3,24.43 v36.06,24.43 | v36.06,24.43 36.37,24.43 | v36.06,24.43 35.84,24.41 | C10.2 48.03,24.32 v48.38,24.62 | 46.47,28.3 46.9,28.25 v47.05,28.22 | 34.3,26.83 v36.06,26.83 35.86,26.83 35.84,26.81 | 42.71,26.56 v40.95,26.56 41.15,26.56 41.17,26.58 | 46.48,32.01 46.91,31.96 v47.06,31.93 | 41.71,28.36 v40.7,28.86 40.9,28.61 40.67,28.88 | 34.3,32.23 v36.06,32.23 35.86,32.23 35.84,32.21 | 35.05,28.63 v36.31,28.88 36.11,28.88 36.34,28.86 | 34.32,34.05 v36.08,34.05 35.88,34.05 35.86,34.03 | 42.66,32.56 v40.9,32.56 41.1,32.56 41.12,32.58 | 42.63,33.73 v40.87,33.73 41.07,33.73 41.09,33.75 | 34.28,35.87 v36.04,35.87 35.84,35.87 35.82,35.85 | 34.3,37.63 v36.06,37.63 35.86,37.63 35.84,37.61 | 34.32,39.45 v36.08,39.45 35.88,39.45 35.86,39.43 | 34.28,41.27 v36.04,41.27 35.84,41.27 35.82,41.25 | 34.3,43.03 v36.06,43.03 35.86,43.03 35.84,43.01 | 34.32,44.85 v36.08,44.85 35.88,44.85 35.86,44.83 | 34.28,46.67 35.59,46.67 | v36.04,46.67 35.59,46.67 | 35.59,46.67 35.82,46.65 | 34.3,48.43 v36.06,48.43 35.86,48.43 35.84,48.41 | 34.32,50.25 v36.08,50.25 35.88,50.25 35.86,50.23 | 34.28,52.07 v36.04,52.07 35.84,52.07 35.82,52.05 | 34.32,53.85 v36.08,53.85 35.88,53.85 35.86,53.83
  Top 0.203: 34.28,55.67 v36.04,55.67 35.84,55.67 35.82,55.65 | 34.3,57.43 v35.81,57.43 35.86,57.43 35.84,57.41 | 34.32,59.25 v35.83,59.25 35.88,59.25 35.86,59.23 | 34.28,61.07 v35.79,61.07 35.84,61.07 35.82,61.05 | 34.3,62.83 v36.06,62.83 35.86,62.83 35.84,62.81 | 34.32,64.65 v36.08,64.65 35.88,64.65 35.86,64.63 | 35.31,66.37 v36.41,65.83 | 36.07,66.06 36.08,66.11 | 35.29,68.23 v36.36,68.77 | 34.28,70.07 v36.04,70.07 | 35.84,70.07 35.82,70.05 | 41.65,75.12 v40.64,75.62 40.84,75.62 40.61,75.39 | 42.65,76.92 v40.89,76.92 41.09,76.92 41.11,76.94 | R27.1 47.66,79.6 v48.45,78.99 | R26.1 47.68,77.42 v48.56,77.42 | C13.2 48.54,74.94 v49.54,74.94 | 41.9,67.92 v40.64,68.17 41.09,67.92 41.11,67.94 | 42.65,69.72 v40.89,69.72 41.09,69.72 41.11,69.74 | 42.65,64.32 v40.89,64.32 41.09,64.32 41.11,64.34 | 42.65,66.12 v40.89,65.87 41.09,66.12 41.11,66.14 | 42.65,60.72 v40.89,60.72 41.09,60.72 41.11,60.74 | 42.65,62.52 41.34,62.52 | v40.89,62.52 41.34,62.52 | 41.34,62.52 41.11,62.54 | 42.65,57.12 v40.89,57.12 41.09,57.12 41.11,57.14 | 42.65,58.92 41,59 39.92,57.92 v39.89,57.92 41.09,58.92 41.11,58.94 | 42.05,53.52 v40.89,53.52 41.09,53.52 41.11,53.54 | 42.05,55.32 v40.89,55.32 41.09,55.32 41.11,55.34 | 42.05,49.92 v40.89,49.92 41.09,49.92 41.11,49.94 | 42.05,51.72 v40.89,51.72 41.09,51.72 41.11,51.74 | 42.05,46.32 v40.89,46.32 41.09,46.32 41.11,46.34 | 42.05,48.12 v40.89,48.12 41.09,48.12 41.11,48.14 | 42.05,42.72 v40.89,42.72 41.09,42.72 41.11,42.74 | 42.05,37.32 v40.89,37.32 41.09,37.32 41.11,37.34 | 42.05,39.12 v40.89,39.12 41.09,39.12 41.11,39.14 | 42.05,40.92 v40.89,40.92 41.09,40.92 41.11,40.94 | R5.1 47.3,59.4 v47.32,62.22
  Top 0.203: R2.1 45.16,61.84 v45.07,62.34 | U$19.P$5 27.14,34.24 v26.99,34.29 | C17.2 29.51,38.1 v29.21,38.15 | U$19.P$10 29.5,29.66 v29.87,29.29 | Q5.S 40.12,11.78 R21.1 40.5,10.68 v40.46,9.57 | Q2.S 44.66,10.08 v44.96,10.19 | R11.1 19.84,66.54 v19.93,66.46 | R9.2 21.85,57.62 v21.35,57.11 | C9.2 30.07,53.64 v30.09,53.66 | U$20.P$2 28.05,46.93 28.05,46.04 28.93,45.26 C4.2 C2.2 29.77,42.37 v29.88,42.48 | U$21.P$31 37.18,77.25 v37.61,77.23 | U$21.P$37 35.93,75.45 v36.39,75.2 | U$21.P$25 35.77,79.05 v36.39,79.46 | CL2.2 71.88,71.74 v71.13,71.74 | U$18.P$10 76.91,72.76 v78.65,72.76 | U$18.P$5 76.91,76.01 v78.65,76.01 | CL1.2 70.51,80.48 v69.51,80.48 | .C10.2 74.59,80.41 v74.59,81.29 | U$18.P$26 85.04,77.23 v85.87,76.75 | v86.37,80.68 86.35,79.89 .C9.2 | .C8.2 81.73,88.17 v81.7,88.2 | .C7.2 87.78,76.34 v87.49,76.23 | U$21.P$196 41.31,24.15 41.06,24.4 v40.86,24.4 | U$15.ID 35,9.8 v35.37,10.17 35.8,9.74 U$15.GROUND | v29.68,6.52 29.68,8.08 U$15.GND2 | v29.68,4.28 29.68,2.8 U$15.GND1 | v38.62,4.28 38.62,2.76 U$15.GND3 | v38.62,6.52 38.62,8.12 U$15.GND4 | U$21.P$170 U$21.P$168 | R14.2 24.57,10.9 v25.64,11.97
  Top 0.254: U$16.P$6 83.34,9.12 83.59,9.12 U$16.P$9 | U$17.P$3 83.59,23 U$17.P$13 83.59,22.55 U$17.P$9 | C6.2 v90.47,29.22 | C21.2 79.08,21.03 | U$26.P$6 18.88,12.34 18.88,12.59 U$26.P$9
  Top 0.406: C11.2 56.79,95.72 57.52,95.72 v57.52,95.92
  Top 0.61: .C1.C 7.98,48.23 v9.07,49.04 v7.1,49.04 | .C2.2 87.81,4.83 v87.86,5.78 | 82.24,13.77 81.17,14.19 v81.19,13.22 | 79.02,22.09 78.6,21.02 79.08,21.03 v79.57,20.84 | 88.16,23.45 88.58,24.52 v87.61,24.5 | 82.24,31.27 81.17,31.69 v81.19,30.72 | .C16.2 26.69,13.67 v26.64,12.72 | 14.23,11.24 13.81,10.17 v14.78,10.19
  Top 1.016: Q3.3 21.45,76.72 v21.35,76.82
  GND 0.203: 36.62,24.43 v36.06,24.43 | v48.38,24.62 48.23,24.47 48.41,24.59 | v47.05,28.22 46.16,28.26 46.16,28.22 | v47.06,31.93 46.17,31.97 46.17,31.93 | v48.45,78.99 48.45,79.06 | v48.56,77.42 48.34,77.45 48.34,77.85 | v47.32,62.22 47.45,62.32 47.18,62.32 | v45.07,62.34 45,62.11 45.4,62.1 | v26.99,34.29 27.2,34.4 | v29.21,38.15 29.46,38.14 29.6,38 | v29.87,29.29 29.88,28.78 | v40.46,9.57 40.53,9.66 40.4,10.4 | v44.96,10.19 45.28,10.19 | v19.93,66.46 19.72,66.46 | v21.35,57.11 21.15,56.91 | v30.09,53.66 30.29,53.45 | v29.88,42.48 29.68,42.28 | v37.61,77.23 37.4,77.23 | v36.39,75.2 36.18,75.4 | v36.39,79.46 35.98,79.26 | v71.13,71.74 71.13,72.15 | v78.65,72.76 78.85,72.56 | v78.65,76.01 78.85,76.01 | v69.51,80.48 70.12,80.48 | v74.59,81.29 74.59,81.5 | v81.7,88.2 81.7,88.41 | v87.49,76.23 87.39,76.63 | v40.86,24.4 40.65,24.4 | v35.37,10.17 35.57,10.17 35.78,9.97
  GND 1.016: v21.35,76.82 21.55,77.03
  other vias: 87.86,4.78 81.19,14.22 80.19,8.02 81.24,8.02 82.64,9.32 83.59,9.27 84.54,9.32 84.54,10.27 83.59,10.27 82.64,10.17 83.14,9.77 84.04,9.77 82.04,10.47 81.99,9.77 81.94,9.02 85.39,8.99 85.14,9.72 85.39,10.37 86.3,8.91 86.33,10.44 86.01,9.7 78.57,20.84 83.09,21.88 83.1,22.79 83.12,23.65 84.06,23.66 84.06,21.89 84.08,22.74 83.6,23.17 83.57,22.33 88.61,24.5 81.19,31.72 7.23,28.85 9.05,28.84 22.36,76.82 20.33,76.82 20.33,74.59 21.35,74.59 22.36,74.59 29.78,44.87 25.31,28.77 22.26,28.77 19.22,28.77 16.92,28.77 31.41,28.77 31.41,34.25 25.31,34.86 28.87,28.77 26.53,28.77 22.26,24.27 19.22,24.27 16.67,24.27 26.26,24.02 8.13,28.84 8.13,49.01 28.36,84.85 28.46,90.13 31,87.39 25.82,87.59 26.63,89.22 30.29,89.12 30.19,85.69 26.5,85.56 29.48,84.8 31.13,86.27 31.18,88.46 29.65,90.06 27.34,90.11 25.74,88.63 25.77,86.4 27.27,84.8 28.29,18.88 28.39,24.16 30.93,21.42 25.75,21.62 26.56,23.25 30.22,23.14 30.12,19.71 26.43,19.59 29.4,18.83 31.06,20.3 31.11,22.48 29.58,24.08 27.27,24.13 25.67,22.66 25.7,20.43 27.19,18.83 71.47,18.83 71.57,24.12 74.11,21.37 68.93,21.58 69.74,23.2 73.4,23.1 73.3,19.67 69.61,19.54 72.58,18.78 74.24,20.25 74.29,22.44 72.76,24.04 70.45,24.09 68.85,22.62 68.88,20.38 70.37,18.78 71.49,84.9 71.59,90.18 74.13,87.44 68.95,87.64 69.76,89.27 73.42,89.17 73.32,85.74 69.64,85.61 72.61,84.85 74.26,86.32 74.31,88.5 72.79,90.1 70.48,90.16 68.88,88.68 68.9,86.45 70.4,84.85 64.52,83.42 64.5,87.08 66.3,85.2 62.62,85.15 62.72,86.17 63.43,86.93 65.54,86.9 66.25,86.19 66.12,84.19 65.44,83.53 62.82,84.14 63.58,83.53 64.58,21.8 64.55,25.45 66.35,23.57 62.67,23.52 62.77,24.54 63.48,25.3 65.59,25.28 66.3,24.56 66.18,22.56 65.49,21.9 62.87,22.51 63.64,21.9 10,98 14,99 18,99 22,99 30,99 34,99 38,99 42,99 58,99 62,99 66,99 70,99 78,99 82,99 86,99 90,98 91,94 91,90 91,86 91,82 91,78 91,74 98,71 98,63 98,59 98,55 98,51 98,47 98,43 98,39 99,29 99,21 99,17 99,13 97,3 37,1 41,1 45,1 49,1 53,1 57,1 61,1 65,1 69,1 73,1 77,1 81,1 85,1 89,1 9,1 13,1 17,1 21,1 29,1 33,1 2,62 2,58 2,54 2,50 2,46 2,42 2,38 3,3 1,11 1,15 1,19 1,23 1,28 8,76 9,79 9,84 9,88 9,92 26.64,13.72 13.78,10.19 19.98,9.19 19.98,10.24 18.68,11.64 18.73,12.59 18.68,13.54 17.73,13.54 17.73,12.59 17.83,11.64 18.23,12.14 18.23,13.04 17.53,11.04 18.23,10.99 18.98,10.94 19.01,14.39 18.28,14.14 17.63,14.39 19.09,15.3 17.56,15.33 18.3,15.01 26.64,11.97 87.86,3.78 88.86,3.78 88.86,4.78 88.86,5.78
  pour Top (isolate 0.254, no thermals): 79.59,8.77 80.59,8.77 81.59,9.77 81.59,10.77 86.59,10.77 86.59,7.77 79.59,7.77
  pour GND (no thermals): 0,100 100,100 100,0 0,0
  pour Signals: 36.59,23.26 15.8,23.26 15.8,37.6 36.59,37.6
  pour Top: 14,98 85,98 arc-90 90,93 90,73 arc-90 95,68 95,28 arc-90 98,25 98,6 arc-90 93.5,2 7,2 arc-90 2,7 2,25 arc-90 5,28 5,68 arc-90 10,73 10,92 8.5,92 8.5,78.5 0,78.5 0,9 arc-90 0,8.5 0,0 100,0 100,100 14,100
  pour Top (no thermals): 8.5,92 8.5,100 14.5,100 14.5,98 arc90 10,93.5 10,92
  pour Top (no thermals): 8.5,92 8.5,100 14.5,100 14.5,98 arc90 10,93.5 10,92
  pour Top (isolate 0.254, no thermals): 19.23,8.59 19.23,9.59 18.23,10.59 17.23,10.59 17.23,15.59 20.23,15.59 20.23,8.59
  pour Top: 88,6 89,6 89,3.5 88,3.5
INT
  Top 0.203: U$18.P$13 75.77,70.77 75,70 68.1,70 R12.1 R13.1
INT1  (via drill 0.35)
  Top 0.203: R12.2 64.43,74.9 63.73,75.61 55.39,75.61 v50,81 | U$21.P$21 31.75,80.25 v31,81
  DC_distribution 0.203: v50,81 40.19,81 39.54,81.65 35.81,81.65 35.17,81 v31,81
INT2
  Top 0.203: R13.2 51.47,74.9 49.84,76.53 45.43,76.53 45.25,76.35 U$21.P$34
ISO-TOP-VCC  (via drill 0.6)
  Top 0.203: U$20.P$5 27.08,51.53 C5.1 C9.1 27.12,53.66 v23.38,53.66
  DC_distribution 0.203: U$180.8 14.1,59.08 15.35,57.82 19.21,57.82 v23.38,53.66
ISO-TOP-VCC-ENABLE  (via drill 0.6)
  Top 0.203: U$21.P$71 32.19,61.65 v32.12,61.58 | v32.12,55.28 32.12,46.95 29.08,46.95 U$20.P$3
  Signals 0.203: v32.12,61.58 v32.12,55.28
MCU-CS
  Top 0.203: U$21.P$23 28.44,79.65 23.99,75.2 23.99,65.78 17.28,59.14 16.33,59.14 U$180.7
MCU-LDO-EN
  Top 0.203: U$21.P$83 24.93,58.05 19.62,52.74 15.01,52.74 U$180.14
MCU-MUTE
  Top 0.203: U$21.P$89 24.96,56.25 18.91,50.2 15.01,50.2 U$180.16
MCU-PA-EN
  Top 0.203: U$21.P$87 24.54,56.85 19.11,51.42 16.31,51.42 U$180.13
MCU-SCLK  (via drill 0.35, 0.6)
  Top 0.203: U$180.10 14.07,56.54 15.3,57.82 17.34,57.82 v22.16,62.6 | v25.62,62.6 25.62,64.63 26.63,65.65 26.63,66.66 25.82,67.47 25.82,74.38 27.45,76.01 34.36,76.01 U$21.P$35 36.75,76.05 36.99,75.81 38.01,75.81 | 38.01,75.81 38.21,75.81 | 76,70.12 76.01,70.12 U$18.P$14 75.65,68.9 62.77,68.9 57.48,74.18 51.42,74.18 50.81,74.79 v50.81,74.59 | 38.01,75.81 38.61,75.2 38.61,73.68 39.74,72.56 44.11,72.56 44.72,71.95 v45.73,71.95
  Signals 0.203: v22.16,62.6 v25.62,62.6 | v50.81,74.59 50.81,73.77 49.59,72.56 46.34,72.56 v45.73,71.95
MCU-SDI  (via drill 0.6)
  Top 0.203: v25.62,66.05 25.21,66.46 25.21,74.79 27.07,76.65 U$21.P$33 36.76,76.65 37.1,76.31 38.52,76.31 39.02,75.81 39.02,73.85 39.91,72.96 56.98,72.96 62.47,67.47 80.28,67.47 82.92,70.12 U$18.P$15 | v23.58,64.02 23.79,64.06 23.79,62.6 17.69,56.5 16.31,56.5 U$180.9
  Signals 0.203: v25.62,66.05 v23.58,64.02
MCU-SDO  (1 unrouted)
  Top 0.203: U$21.P$29 27.46,77.85 24.6,74.99 24.6,62.39 17.49,55.28 15.01,55.28 U$180.12 | 34.15,77.84 36.89,77.84 37.3,78.25 39.23,78.25 39.43,78.05 39.43,74.02 40.08,73.37 57.15,73.37 62.53,67.98 69.51,67.98 | 69.51,67.98 69.3,67.98 | 69.51,67.98 79.87,67.98 82.61,70.73 84.03,70.73 U$18.P$16
MCU-STAT
  Top 0.203: U$21.P$81 24.72,58.65 20.13,54.06 16.33,54.06 U$180.11
N$1
  Top 0.254: U$17.P$8 89.72,22.1 89.72,18.47 85.44,18.46 L1.P$1
N$2
  Top 0.254: U$16.P$4 80.59,11.17 .C3.1
N$3
  Top 0.203: Q2.D 43.49,12.84 Q1.S
N$4
  Top 0.254: L2.P$1 81.59,26.77 77.63,26.77 77.63,23.45 80.89,23.45 U$17.P$2
N$5
  Top 0.61: 84.64,11.17 84.04,11.17
N$6  (via drill 0.6)
  Top 0.254: U$17.P$12 v85.59,24.37 | v87.94,26.27 R1.1 C6.1
  Signals 0.254: v85.59,24.37 v87.94,26.27
N$7
  Top 0.203: U$21.P$28 42.67,78.08 44.17,78.08 45.53,79.54 R27.2
N$8
  Top 0.203: U$21.P$30 42.63,77.58 44.86,77.58 45.74,77.5 R26.2
N$9
  Top 0.203: 27.45,30.2 U$19.P$6 27.45,30.1 27.45,27.85 22.97,23.38 22.97,19.52 31.71,10.78 33.34,10.78 33.34,8.44 U$15.DATA-
N$10
  Top 0.203: U$19.P$7 28.05,30.1 28.05,27.65 23.58,23.18 23.58,19.72 31.91,11.39 33.34,11.39 34.15,10.58 34.15,8.23 U$15.DATA+
N$11  (2 unrouted)
  Top 0.203: 28.47,30.13 U$19.P$8 28.51,31.47 28.26,31.72 17.98,31.74 17.59,32.12 17.59,34.11 16.64,34.96 16.53,34.8
N$12  (2 unrouted)
  Top 0.203: 29.03,30.19 29.02,30.2 29.02,31.71 28.52,32.21 18.32,32.23 18.1,32.45 18.1,34.13 18.84,34.8 19.33,34.91
N$13  (via drill 0.6)
  Top 0.203: v36.8,17 37.03,16.77 R4.1 38.6,16.65 38.6,15.8 39.62,14.78 Q5.D | v28.4,35.6 29,35.6 U$19.P$2 | U$19.P$2
  DC_distribution 0.203: v36.8,17 36.8,21.76 32.22,25.21 32.22,31.68 28.4,31.68 v28.4,35.6
N$14
  Top 0.203: U$21.P$82 42.64,58.31 45.09,58.31 45.08,58.8 R2.2
N$15
  Top 0.203: U$21.P$84 45.07,57.74 47.3,57.71 R5.2
N$16
  Top 0.203: U$20.P$4 28.98,51.53 C5.2
N$17
  Top 0.203: R6.1 86.62,70.48 85.56,71.54 85.56,71.74 85.36,71.95 84.2,71.95 U$18.P$18
N$18
  Top 0.203: U$18.P$24 85.09,75.97 85.25,75.81 85.56,75.81 85.56,73.37 U$18.P$20
N$21
  Top 0.203: R7.2 83.43,87.12 .C8.1 79.93,87.22 R8.2
N$23
  Top 0.203: U$18.P$9 74.18,73.37 74.14,73.41 | 74.14,73.41 74.14,73.77 U$24.P$3 | CL2.1 74.14,72.2 74.14,73.41
N$24
  Top 0.203: U$18.P$8 75.44,74.02 75.4,73.98 75.4,76.39 72.61,76.39 71.94,77.06 71.94,78.2 | U$24.P$1 71.94,78.2 | 71.94,78.2 72.14,78.26 CL1.1
N$25
  Top 0.203: U$18.P$28 83.99,78.65 82.51,78.65 82.51,73.98 82.56,74.02 U$18.P$21
N$26
  Top 0.203: Q3.1 21.45,69.2 21.75,68.9 20.05,68.9 R11.2
  Top 0.406: Q3.1 21.45,69.15 R10.2
N$31
  Top 0.254: U$26.P$4 16.83,9.59 .C17.1
N$32
  Top 0.61: 16.83,13.64 16.83,13.04
Q2
  Top 0.203: Q2.G 42.99,9.19 43.06,9.12 45.92,9.12 R3.1
SDR-EN  (via drill 0.35)
  Top 0.203: R16.1 28,9.35 v28,10 | U$21.P$78 38.45,59.55 v38,59
  Signals 0.203: v28,10 37,19 37,22 39,24 39,58 v38,59
SDX_CLK  (via drill 0.35)
  Top 0.203: U$21.P$10 47.58,83.55 49.39,85.36 49.39,89.22 48.17,90.44 v48.17,92.88
  GND 0.203: v48.17,92.88 48.17,98.61 U$22.P$5
SDX_CMD  (via drill 0.35)
  Top 0.203: U$21.P$12 48,82.95 50.41,85.36 v50.41,92.88
  GND 0.203: v50.41,92.88 50.41,98.61 U$22.P$3
SDX_D0  (via drill 0.35)
  Top 0.203: U$21.P$16 41.46,81.75 41.23,81.51 40.55,81.51 40.08,81.98 40.08,85.04 41.47,86.43 41.52,86.43 45.94,90.84 v45.94,92.88
  GND 0.203: v45.94,92.88 45.94,98.58 U$22.P$7
SDX_D1  (via drill 0.35)
  Top 0.203: U$21.P$18 41.44,81.15 41.39,81.11 40.39,81.11 39.68,81.82 39.68,85.21 41.3,86.84 41.35,86.84 44.53,90.01 44.53,92.66 44.51,92.67 v44.51,92.88
  GND 0.203: v44.51,92.88 44.94,93.3 U$22.P$8
SDX_D2  (via drill 0.35)
  Top 0.203: U$21.P$22 42.82,79.97 43.83,79.97 46.2,82.54 48.17,82.54 52.84,87.22 52.84,92.88 v52.64,92.88
  GND 0.203: v52.64,92.88 52.64,98.57 U$22.P$1
SDX_D3  (via drill 0.35)
  Top 0.203: U$21.P$24 42.72,79.47 43.73,79.47 43.82,79.56 43.83,79.56 43.99,79.56 44,79.57 44.01,79.57 44.12,79.69 44.23,79.8 46.39,82.14 48.34,82.14 53.45,87.25 53.45,94.09 52.03,95.52 51.63,95.52 v51.42,95.31
  GND 0.203: v51.42,95.31 51.49,95.38 U$22.P$2
UART_RX  (via drill 0.6)
  Top 0.203: U$21.P$53 34.43,67.02 35.97,67.02 35.98,67.01 36.31,67.01 36.98,66.59 v38.06,66.34
  Signals 0.203: v38.06,66.34 38.24,66.77 49.28,66.77 52.39,66.66 52.39,9.36 46.55,8.52 JP1.2
UART_TX  (via drill 0.6)
  Top 0.203: U$21.P$51 v37.04,67.65
  Signals 0.203: v37.04,67.65 37.29,67.27 53,67.27 53,8.05 JP1.3
USB_DM
  Top 0.203: U$19.P$4 28,33.37 28.52,32.85 U$21.P$167
USB_DP
  Top 0.203: U$19.P$3 28.5,33.73 28.78,33.45 U$21.P$165
VBAT_DIRTY  (via drill 0.6)  (9 unrouted)
  Top 0.203: U$20.P$1 27.13,47 C4.1 C2.1 26.3,42.6 v25.99,42.5 | R15.1 v22,12.5
  Top 0.254: .C2.1 84.66,4.83 84.34,7.57 | 84.34,7.57 U$16.P$8 U$16.P$7 | U$16.P$5 82.79,8.37 82.79,7.57 84.34,7.57 | .C16.1 23.17,14.16 20.43,13.84 20.43,12.29 | U$26.P$8 U$26.P$7
  Top 0.305: 7.98,40.23 7.98,41.48
  Top 0.5: 20.43,13.84 U$26.P$8
  Top 0.61: 7.98,41.48 8.23,40.88
  Top 1: U$180.2 10.89,64.5 10.85,64.46
  Top 1.016: 10.85,64.46 10.78,40.57 10.78,42.28
  Top 1.27: 7.98,40.23 7.76,40.12 10.78,40.57 | v82,6 v84,7 | 21.5,13 v21,13.5
  Signals 1.27: 78,10 78,8 80,6 v82,6
  Signals 2.4: 58,15 v58,14.66
  Signals 2.54: v58.61,46.28 58.61,33.39 58,32 58,15 68,10 78,10
  DC_distribution 2.4: v58,14.66 54.34,12 47,12 46,13 32,13 29,16 23,16 23,14.5 v22,13.5
  GND 0.406: CONN1.P$7 56.27,46.34 v57.67,46.34 | CONN1.P$8 57.78,44.81 57.88,44.72 v57.67,44.72
  other vias: 58.6,44.7 59.52,46.34 59.52,44.7 58.17,45.52 59.17,45.52 83,6 83,7 84,6 21,12.5 57,14.65 57,13.65 58,13.65 59,13.65 59,12.65 58,12.65 57,12.65
  pour Top: 10.48,44.92 17.89,44.92 17.89,39.23 10.48,39.23
  pour DC_distribution: 15.25,45.33 17.89,45.33 21.76,49.19 60.52,49.19 61.33,48.37 61.33,36.68 17.69,36.79 15.05,41.06 15.05,45.12
  pour DC_distribution (no thermals): 56,12 60,12 60,14 59,15 56,15
  pour Signals (no thermals): 56,12 60,12 60,14 59,15 56,15
VBUSB
  Top 0.203: Q1.G 42.51,13.35 41.84,14.02 39.78,14.02 Q5.G 38.7,12.94 R21.2 36.79,9.49 36.79,6.11 36.59,5.91 32.73,5.91 32.6,6.03 U$15.VCC
(copper drawn outside any net)
  shapes: GND area x2, Top area x1, Top circle x6

### Text on the board
tSilk: CAN / termination | GND | Rx | Tx